# Altium project JLB_PCB.PrjPcb (part 1 of 2)
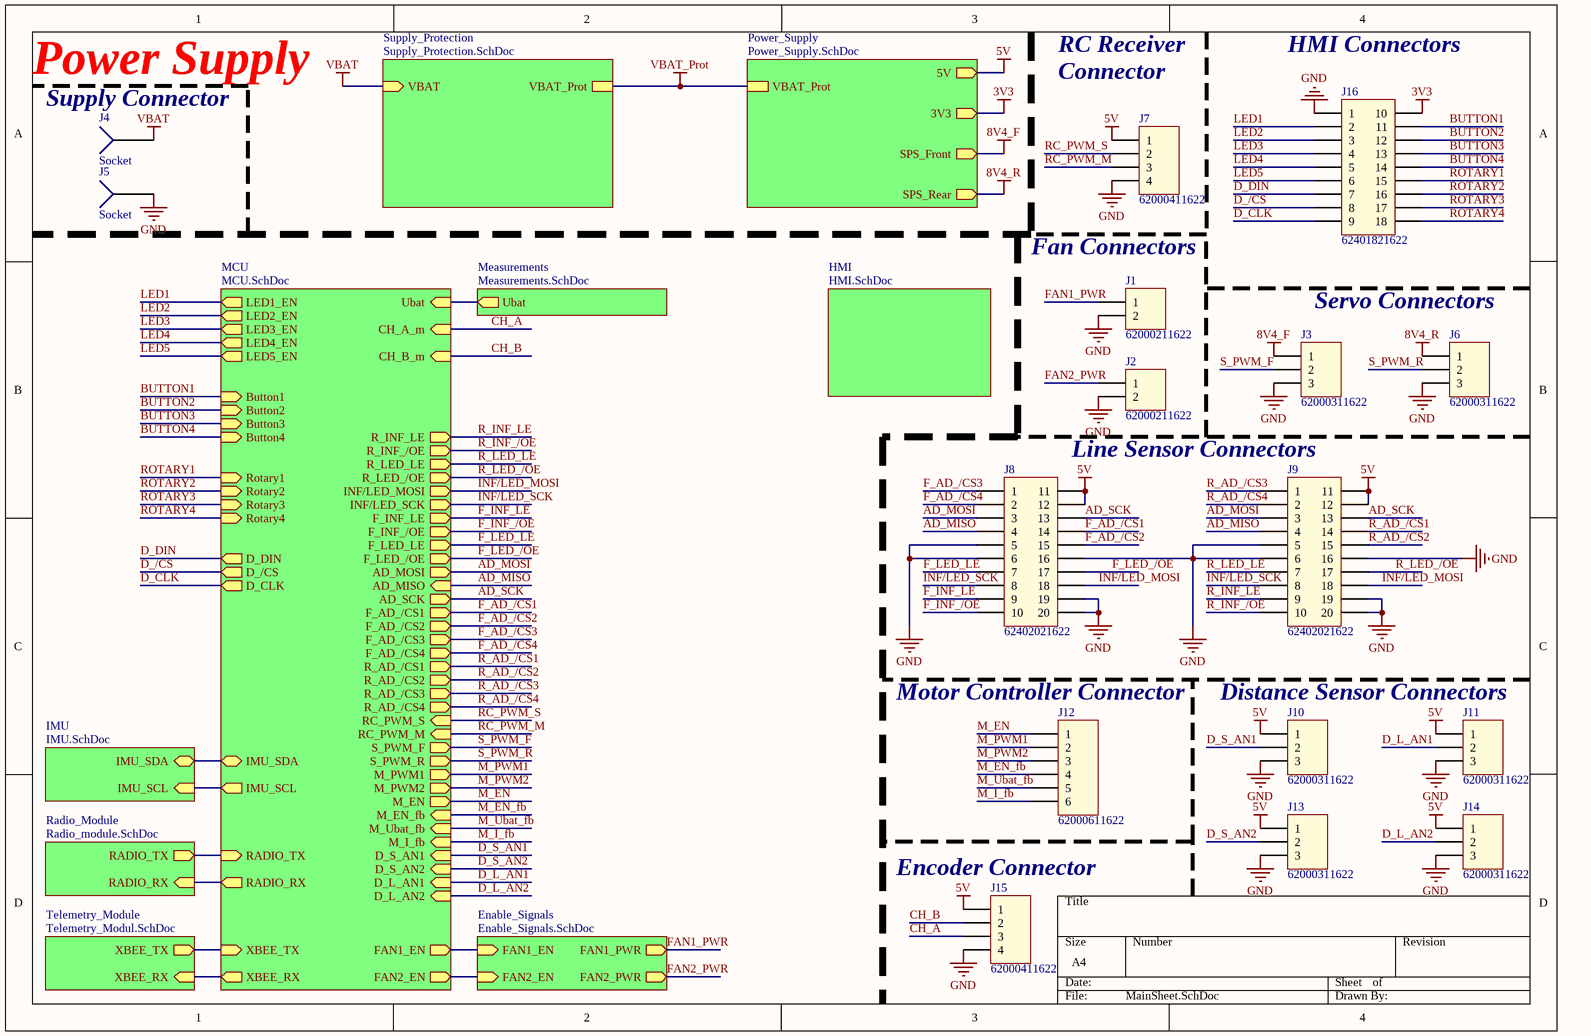
[diagram p0: MainSheet.SchDoc]
18 sheets, 177 parts. Net scope: hierarchical (ports join the sheet entries above them; power ports are global).
Board file: JLB_PCB.PcbDoc
Sheets:
  MainSheet.SchDoc
    MCU = MCU.SchDoc
    Supply_Protection = Supply_Protection.SchDoc
    Power_Supply = Power_Supply.SchDoc
      5V_Supply = 5V_Supply.SchDoc
      3V3_Supply = 3V3_Supply.SchDoc
      Servo_Power_Supply = Servo_Power_Supply.SchDoc
        Front_Servo_Supply = Front_Servo_Supply.SchDoc
        Rear_Servo_Supply = Rear_Servo_Supply.SchDoc
    IMU = IMU.SchDoc
    Telemetry_Module = Telemetry_Modul.SchDoc
    Radio_Module = Radio_module.SchDoc
    HMI = HMI.SchDoc
      LEDs = HMI_LEDs.SchDoc
      Buttons & Rotary = HMI_Buttons.SchDoc
      Display = Display.SchDoc
    Measurements = Measurements.SchDoc
    Enable_Signals = Enable_Signals.SchDoc

## Sheet MainSheet.SchDoc
size A4; SheetNumber: 1; SheetTotal: 18

### Parts
J1  62000211622  [62000211622]
J2  62000211622  [62000211622]
J3  62000311622  [62000311622]
J4  Socket  [TAB 6.35MM x 0.81MM]
J5  Socket  [TAB 6.35MM x 0.81MM]
J6  62000311622  [62000311622]
J7  62000411622  [62000411622]
J8  62402021622  [62402021622]
J9  62402021622  [62402021622]
J10  62000311622  [62000311622]
J11  62000311622  [62000311622]
J12  62000611622  [62000611622]
J13  62000311622  [62000311622]
J14  62000311622  [62000311622]
J15  62000411622  [62000411622]
J16  62401821622  [62401821622]

### Sub-sheets
Enable_Signals = Enable_Signals.SchDoc: FAN1_PWR (out), FAN2_PWR (out), FAN1_EN (in), FAN2_EN (in)
HMI = HMI.SchDoc: no entries
IMU = IMU.SchDoc: IMU_SDA (bidir), IMU_SCL (in)
MCU = MCU.SchDoc: Ubat (in), IMU_SDA (bidir), IMU_SCL (out), RADIO_TX (in), RADIO_RX (out), XBEE_TX (in), XBEE_RX (out), FAN2_EN (out), FAN1_EN (out), D_L_AN2 (in), D_L_AN1 (in), D_S_AN2 (in), D_S_AN1 (in), M_I_fb (in), M_Ubat_fb (in), M_EN_fb (in), M_EN (out), M_PWM2 (out), M_PWM1 (out), S_PWM_R (out), S_PWM_F (out), RC_PWM_M (in), RC_PWM_S (in), R_AD_/CS4 (out), R_AD_/CS3 (out), R_AD_/CS2 (out), R_AD_/CS1 (out), F_AD_/CS4 (out), CH_B_m (in), CH_A_m (in), F_AD_/CS3 (out), F_AD_/CS2 (out), F_AD_/CS1 (out), AD_SCK (out), AD_MISO (in), AD_MOSI (out), F_LED_/OE (out), F_LED_LE (out), F_INF_/OE (out), F_INF_LE (out), INF/LED_SCK (out), INF/LED_MOSI (out), R_LED_/OE (out), R_LED_LE (out), R_INF_/OE (out), R_INF_LE (out), LED1_EN (out), LED2_EN (out), LED3_EN (out), LED4_EN (out), LED5_EN (out), Button1 (in), Button3 (in), Button4 (in), Button2 (in), D_DIN (out), D_/CS (out), D_CLK (out), Rotary1 (in), Rotary2 (in), Rotary3 (in), Rotary4 (in)
Measurements = Measurements.SchDoc: Ubat (out)
Power_Supply = Power_Supply.SchDoc: VBAT_Prot, 5V (out), 3V3 (out), SPS_Rear (out), SPS_Front (out)
Radio_Module = Radio_module.SchDoc: RADIO_TX (out), RADIO_RX (in)
Supply_Protection = Supply_Protection.SchDoc: VBAT (in), VBAT_Prot
Telemetry_Module = Telemetry_Modul.SchDoc: XBEE_TX (out), XBEE_RX (in)

### Nets
3V3: J16.10 ; sheet Power_Supply/3V3
5V: J7.1 J8.11 J8.12 J9.11 J9.12 J10.1 J11.1 J13.1 J14.1 J15.1 ; sheet Power_Supply/5V
8V4_F: J3.1 ; sheet Power_Supply/SPS_Front
8V4_R: J6.1 ; sheet Power_Supply/SPS_Rear
GND: J1.2 J2.2 J3.3 J5.1 J6.3 J7.4 J8.5 J8.6 J8.16 J8.19 J8.20 J9.5 J9.6 J9.16 J9.19 J9.20 J10.3 J11.3 J13.3 J14.3 J15.4 J16.1
VBAT: J4.1 ; sheet Supply_Protection/VBAT
VBAT_Prot: sheet Supply_Protection/VBAT_Prot, sheet Power_Supply/VBAT_Prot
AD_MISO: J8.4 J9.4 ; sheet MCU/AD_MISO
AD_MOSI: J8.3 J9.3 ; sheet MCU/AD_MOSI
AD_SCK: J8.13 J9.13 ; sheet MCU/AD_SCK
BUTTON1: J16.11 ; sheet MCU/Button1
BUTTON2: J16.12 ; sheet MCU/Button2
BUTTON3: J16.13 ; sheet MCU/Button3
BUTTON4: J16.14 ; sheet MCU/Button4
CH_A: J15.3 ; sheet MCU/CH_A_m
CH_B: J15.2 ; sheet MCU/CH_B_m
D_/CS: J16.8 ; sheet MCU/D_/CS
D_CLK: J16.9 ; sheet MCU/D_CLK
D_DIN: J16.7 ; sheet MCU/D_DIN
D_L_AN1: J11.2 ; sheet MCU/D_L_AN1  [project net AIN3]
D_L_AN2: J14.2 ; sheet MCU/D_L_AN2  [project net AIN4]
D_S_AN1: J10.2 ; sheet MCU/D_S_AN1  [project net AIN1]
D_S_AN2: J13.2 ; sheet MCU/D_S_AN2  [project net AIN2]
F_AD_/CS1: J8.14 ; sheet MCU/F_AD_/CS1  [project net ADCF1]
F_AD_/CS2: J8.15 ; sheet MCU/F_AD_/CS2  [project net ADCF2]
F_AD_/CS3: J8.1 ; sheet MCU/F_AD_/CS3  [project net ADCF3]
F_AD_/CS4: J8.2 ; sheet MCU/F_AD_/CS4  [project net ADCF4]
F_INF_/OE: J8.10 ; sheet MCU/F_INF_/OE
F_INF_LE: J8.9 ; sheet MCU/F_INF_LE  [project net ILEF]
F_LED_/OE: J8.17 ; sheet MCU/F_LED_/OE
F_LED_LE: J8.7 ; sheet MCU/F_LED_LE
FAN1: sheet MCU/FAN1_EN, sheet Enable_Signals/FAN1_EN
FAN1_PWR: J1.1 ; sheet Enable_Signals/FAN1_PWR
FAN2: sheet MCU/FAN2_EN, sheet Enable_Signals/FAN2_EN
FAN2_PWR: J2.1 ; sheet Enable_Signals/FAN2_PWR
INF/LED_MOSI: J8.18 J9.18 ; sheet MCU/INF/LED_MOSI
INF/LED_SCK: J8.8 J9.8 ; sheet MCU/INF/LED_SCK
LED1: J16.2 ; sheet MCU/LED1_EN
LED2: J16.3 ; sheet MCU/LED2_EN
LED3: J16.4 ; sheet MCU/LED3_EN
LED4: J16.5 ; sheet MCU/LED4_EN
LED5: J16.6 ; sheet MCU/LED5_EN
LV_BATT: sheet MCU/Ubat, sheet Measurements/Ubat
M_EN: J12.1 ; sheet MCU/M_EN  [project net DRIVE_EN]
M_EN_fb: J12.4 ; sheet MCU/M_EN_fb  [project net FB]
M_I_fb: J12.6 ; sheet MCU/M_I_fb  [project net CURR]
M_PWM1: J12.2 ; sheet MCU/M_PWM1
M_PWM2: J12.3 ; sheet MCU/M_PWM2
M_Ubat_fb: J12.5 ; sheet MCU/M_Ubat_fb  [project net BATT]
R_AD_/CS1: J9.14 ; sheet MCU/R_AD_/CS1  [project net ADCR1]
R_AD_/CS2: J9.15 ; sheet MCU/R_AD_/CS2  [project net ADCR2]
R_AD_/CS3: J9.1 ; sheet MCU/R_AD_/CS3  [project net ADCR3]
R_AD_/CS4: J9.2 ; sheet MCU/R_AD_/CS4  [project net ADCR4]
R_INF_/OE: J9.10 ; sheet MCU/R_INF_/OE  [project net IOER]
R_INF_LE: J9.9 ; sheet MCU/R_INF_LE  [project net ILER]
R_LED_/OE: J9.17 ; sheet MCU/R_LED_/OE
R_LED_LE: J9.7 ; sheet MCU/R_LED_LE
RADIO_RX: sheet MCU/RADIO_RX, sheet Radio_Module/RADIO_RX
RADIO_TX: sheet MCU/RADIO_TX, sheet Radio_Module/RADIO_TX
RC_PWM_M: J7.3 ; sheet MCU/RC_PWM_M
RC_PWM_S: J7.2 ; sheet MCU/RC_PWM_S
ROTARY1: J16.15 ; sheet MCU/Rotary1
ROTARY2: J16.16 ; sheet MCU/Rotary2
ROTARY3: J16.17 ; sheet MCU/Rotary3
ROTARY4: J16.18 ; sheet MCU/Rotary4
S_PWM_F: J3.2 ; sheet MCU/S_PWM_F
S_PWM_R: J6.2 ; sheet MCU/S_PWM_R
SCL: sheet MCU/IMU_SCL, sheet IMU/IMU_SCL
SDA: sheet MCU/IMU_SDA, sheet IMU/IMU_SDA
XBEE_RX: sheet MCU/XBEE_RX, sheet Telemetry_Module/XBEE_RX
XBEE_TX: sheet MCU/XBEE_TX, sheet Telemetry_Module/XBEE_TX

### Notes on the sheet
- Power Supply
- (near J4) Supply Connector
- RC Receiver
- Connector
- HMI Connectors
- Fan Connectors
- Servo Connectors
- Line Sensor Connectors
- (near J12) Motor Controller Connector
- Distance Sensor Connectors
- (near J15) Encoder Connector

### Library data of the parts
J1 J2 = 62000211622: WR-WTB 2.00mm Male Vertical Shrouded Header, 2p; Pin Number: 2; ID: WE 1x2 Vertical THT; Note: Positive Lock; ComponentLink1Description: Manufacturer; ComponentLink1URL: http://www.we-online.de; ComponentLink2Description: Datasheet; ComponentLink2URL: http://katalog.we-online.de/em/datasheet/6200xx11622.pdf; Part Number: 62000211622; Published Date: June 2017; Publisher: Wurth Elektronik; Pitch: 2.00 mm; Order Number: 62000211622; Package: 62000211622; NI part number: -; NI PEN/DEB: -; Type: Header WE 2-way; Distributor: Würth; Link: http://katalog.we-online.de/em/datasheet/6200xx11622.pdf; Price (HUF): 0
J3 J6 J10 J11 J13 J14 = 62000311622: WR-WTB 2.00mm Male Vertical Shrouded Header, 3p; Pin Number: 3; ID: WE 1x3 Vertical THT; Note: Positive Lock; ComponentLink1Description: Manufacturer; ComponentLink1URL: http://www.we-online.de; ComponentLink2Description: Datasheet; ComponentLink2URL: http://katalog.we-online.de/em/datasheet/6200xx11622.pdf; Part Number: 62000311622; Published Date: June 2017; Publisher: Wurth Elektronik; Pitch: 2.00 mm; Order Number: 62000311622; Package: 62000311622; NI part number: -; NI PEN/DEB: -; Type: Header WE 3-way; Distributor: Würth; Link: http://katalog.we-online.de/em/datasheet/6200xx11622.pdf; Price (HUF): 0
J4 J5 = 1217861-1 TERMINAL: ID: Con_1217861-1 TERMINAL; Order number: 1924184; Distributor: Farnell; Link: http://hu.farnell.com/te-connectivity-amp/1217861-1/terminal-tab-6-35mm-x-0-81mm-solder/dp/1924184?ost=1924184&selectedCategoryId=&categoryName=%C3%96sszes+kateg%C3%B3ria&categoryNameResp=%C3%96sszes+kateg%C3%B3ria; Package: TAB 6.35MM x 0.81MM; Part Number: 1217861-1 TERMINAL; Price (HUF): 22; Type: TAB; NI part number: -; NI PEN/DEB: -
J7 J15 = 62000411622: WR-WTB 2.00mm Male Vertical Shrouded Header, 4p; Pin Number: 4; ID: WE 1x4 Vertical THT; Note: Positive Lock; ComponentLink1Description: Manufacturer; ComponentLink1URL: http://www.we-online.de; ComponentLink2Description: Datasheet; ComponentLink2URL: http://katalog.we-online.de/em/datasheet/6200xx11622.pdf; Part Number: 62000411622; Published Date: June 2017; Publisher: Wurth Elektronik; Pitch: 2.00 mm; Order Number: 62000411622; Package: 62000411622; NI part number: -; NI PEN/DEB: -; Type: Header WE 4-way; Distributor: Würth; Link: http://katalog.we-online.de/em/datasheet/6200xx11622.pdf; Price (HUF): 0
J8 J9 = 62402021622: WR-WTB 2.00mm Male Dual Row Vertical Shrouded Header with positive locking, 20p; Pin Number: 20; ID: WE 2x10 Vertical THT; ComponentLink1Description: Manufacturer; ComponentLink1URL: http://www.we-online.de; ComponentLink2Description: Datasheet; ComponentLink2URL: http://katalog.we-online.de/em/datasheet/6240xx21622.pdf; Part Number: 62402021622; Published Date: June 2017; Publisher: Wurth Elektronik; Pitch: 2.00 mm; Order Number: 62402021622; Package: 62402021622; NI part number: -; NI PEN/DEB: -; Type: Header WE 20-way; Distributor: Würth; Link: http://katalog.we-online.de/em/datasheet/6240xx21622.pdf; Price (HUF): 0; Note: Positive Lock
J12 = 62000611622: WR-WTB 2.00mm Male Vertical Shrouded Header, 6p; Pin Number: 6; ID: WE 1x6 Vertical THT; Note: Positive Lock; ComponentLink1Description: Manufacturer; ComponentLink1URL: http://www.we-online.de; ComponentLink2Description: Datasheet; ComponentLink2URL: http://katalog.we-online.de/em/datasheet/6200xx11622.pdf; Part Number: 62000611622; Published Date: June 2017; Publisher: Wurth Elektronik; Pitch: 2.00 mm; Order Number: 62000611622; Package: 62000611622; NI part number: -; NI PEN/DEB: -; Type: Header WE 6-way; Distributor: Würth; Link: http://katalog.we-online.de/em/datasheet/6200xx11622.pdf; Price (HUF): 0
J16 = 62401821622: WR-WTB 2.00mm Male Dual Row Vertical Shrouded Header with positive locking, 18p; Pin Number: 18; ID: WE 2x9 Vertical THT; ComponentLink1Description: Manufacturer; ComponentLink1URL: http://www.we-online.de; ComponentLink2Description: Datasheet; ComponentLink2URL: http://katalog.we-online.de/em/datasheet/6240xx21622.pdf; Part Number: 62401821622; Published Date: June 2017; Publisher: Wurth Elektronik; Pitch: 2.00 mm; Order Number: 62401821622; Package: 62401821622; NI part number: -; NI PEN/DEB: -; Type: Header WE 18-way; Distributor: Würth; Link: http://katalog.we-online.de/em/datasheet/6240xx21622.pdf; Price (HUF): 0; Note: Positive Lock

## Sheet MCU.SchDoc
size A4; SheetNumber: 2; SheetTotal: 18
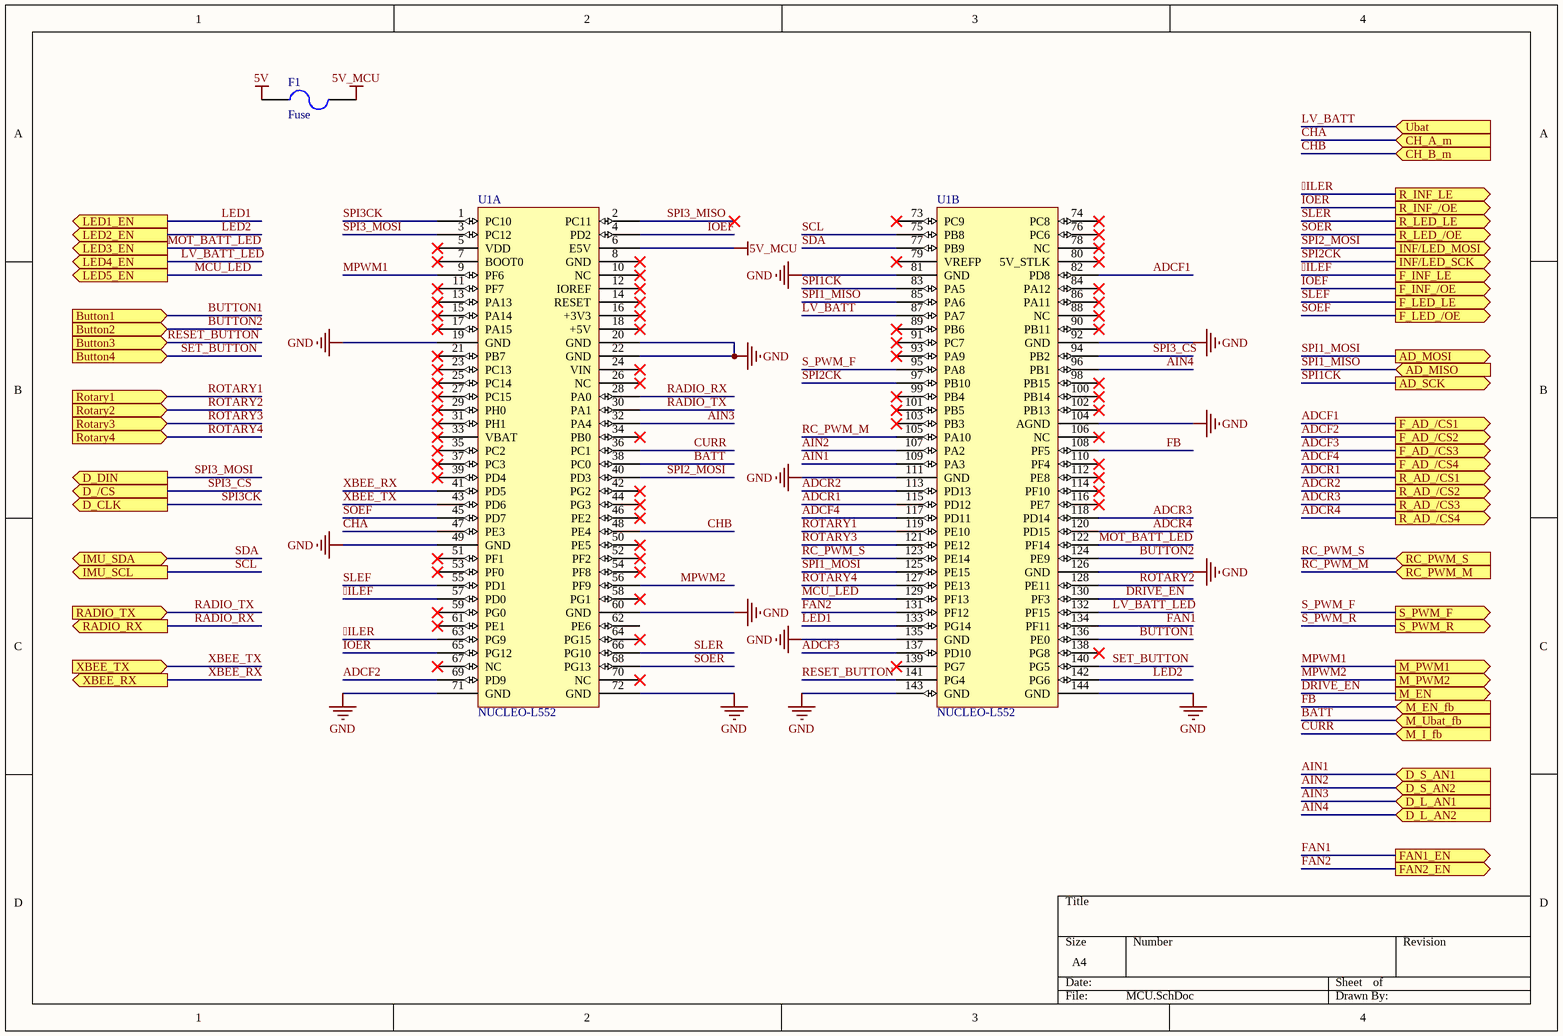
[diagram p1: MCU.SchDoc]

### Parts
F1  Fuse  [F_0603]
U1  NUCLEO-L552  [FP_NUCLEO-144]  (parts A,B of 2)

### Ports
AD_MISO (in), AD_MOSI (out), AD_SCK (out), Button1 (in), Button2 (in), Button3 (in), Button4 (in), CH_A_m (in), CH_B_m (in), D_/CS (out), D_CLK (out), D_DIN (out), D_L_AN1 (in), D_L_AN2 (in), D_S_AN1 (in), D_S_AN2 (in), F_AD_/CS1 (out), F_AD_/CS2 (out), F_AD_/CS3 (out), F_AD_/CS4 (out), F_INF_/OE (out), F_INF_LE (out), F_LED_/OE (out), F_LED_LE (out), FAN1_EN (out), FAN2_EN (out), IMU_SCL (out), IMU_SDA (bidir), INF/LED_MOSI (out), INF/LED_SCK (out), LED1_EN (out), LED2_EN (out), LED3_EN (out), LED4_EN (out), LED5_EN (out), M_EN (out), M_EN_fb (in), M_I_fb (in), M_PWM1 (out), M_PWM2 (out), M_Ubat_fb (in), R_AD_/CS1 (out), R_AD_/CS2 (out), R_AD_/CS3 (out), R_AD_/CS4 (out), R_INF_/OE (out), R_INF_LE (out), R_LED_/OE (out), R_LED_LE (out), RADIO_RX (out), RADIO_TX (in), RC_PWM_M (in), RC_PWM_S (in), Rotary1 (in), Rotary2 (in), Rotary3 (in), Rotary4 (in), S_PWM_F (out), S_PWM_R (out), Ubat (in), XBEE_RX (out), XBEE_TX (in)

### Nets
5V: F1.1
5V_MCU: F1.2 U1.6(E5V)
GND: U1.19(GND) U1.20(GND) U1.22(GND) U1.49(GND) U1.60(GND) U1.71(GND) U1.72(GND) U1.81(GND) U1.92(GND) U1.104(AGND) U1.111(GND) U1.126(GND) U1.135(GND) U1.143(GND) U1.144(GND)
ILEF: U1.57(PD0) ; port F_INF_LE
ILER: U1.63(PG9) ; port R_INF_LE
ADCF1: U1.82(PD8) ; port F_AD_/CS1
ADCF2: U1.69(PD9) ; port F_AD_/CS2
ADCF3: U1.137(PD10) ; port F_AD_/CS3
ADCF4: U1.117(PD11) ; port F_AD_/CS4
ADCR1: U1.115(PD12) ; port R_AD_/CS1
ADCR2: U1.113(PD13) ; port R_AD_/CS2
ADCR3: U1.118(PD14) ; port R_AD_/CS3
ADCR4: U1.120(PD15) ; port R_AD_/CS4
AIN1: U1.109(PA3) ; port D_S_AN1
AIN2: U1.107(PA2) ; port D_S_AN2
AIN3: U1.32(PA4) ; port D_L_AN1
AIN4: U1.96(PB1) ; port D_L_AN2
BATT: U1.38(PC0) ; port M_Ubat_fb
BUTTON1: U1.136(PE0) ; port Button1
BUTTON2: U1.124(PE9) ; port Button2
CHA: U1.47(PE3) ; port CH_A_m  [project net CH_A]
CHB: U1.48(PE4) ; port CH_B_m  [project net CH_B]
CURR: U1.36(PC1) ; port M_I_fb
DRIVE_EN: U1.130(PF3) ; port M_EN
FAN1: U1.134(PF11) ; port FAN1_EN
FAN2: U1.131(PF12) ; port FAN2_EN
FB: U1.108(PF5) ; port M_EN_fb
IOEF: U1.4(PD2) ; port F_INF_/OE  [project net F_INF_/OE]
IOER: U1.65(PG12) ; port R_INF_/OE
LED1: U1.133(PG14) ; port LED1_EN
LED2: U1.142(PG6) ; port LED2_EN
LV_BATT: U1.87(PA7) ; port Ubat
LV_BATT_LED: U1.132(PF15) ; port LED4_EN  [project net LED4]
MCU_LED: U1.129(PF13) ; port LED5_EN  [project net LED5]
MOT_BATT_LED: U1.122(PF14) ; port LED3_EN  [project net LED3]
MPWM1: U1.9(PF6) ; port M_PWM1  [project net M_PWM1]
MPWM2: U1.56(PF9) ; port M_PWM2  [project net M_PWM2]
RADIO_RX: U1.28(PA0) ; port RADIO_RX
RADIO_TX: U1.30(PA1) ; port RADIO_TX
RC_PWM_M: U1.105(PA10) ; port RC_PWM_M
RC_PWM_S: U1.123(PE14) ; port RC_PWM_S
RESET_BUTTON: U1.141(PG4) ; port Button3  [project net BUTTON3]
ROTARY1: U1.119(PE10) ; port Rotary1
ROTARY2: U1.128(PE11) ; port Rotary2
ROTARY3: U1.121(PE12) ; port Rotary3
ROTARY4: U1.127(PE13) ; port Rotary4
S_PWM_F: U1.95(PA8) ; port S_PWM_F
SCL: U1.75(PB8) ; port IMU_SCL
SDA: U1.77(PB9) ; port IMU_SDA
SET_BUTTON: U1.140(PG5) ; port Button4  [project net BUTTON4]
SLEF: U1.55(PD1) ; port F_LED_LE  [project net F_LED_LE]
SLER: U1.66(PG10) ; port R_LED_LE  [project net R_LED_LE]
SOEF: U1.45(PD7) ; port F_LED_/OE  [project net F_LED_/OE]
SOER: U1.68(PG13) ; port R_LED_/OE  [project net R_LED_/OE]
SPI1_MISO: U1.85(PA6) ; port AD_MISO  [project net AD_MISO]
SPI1_MOSI: U1.125(PE15) ; port AD_MOSI  [project net AD_MOSI]
SPI1CK: U1.83(PA5) ; port AD_SCK  [project net AD_SCK]
SPI2_MOSI: U1.40(PD3) ; port INF/LED_MOSI  [project net INF/LED_MOSI]
SPI2CK: U1.97(PB10) ; port INF/LED_SCK  [project net INF/LED_SCK]
SPI3_CS: U1.94(PB2) ; port D_/CS  [project net D_/CS]
SPI3_MISO: U1.2(PC11)
SPI3_MOSI: U1.3(PC12) ; port D_DIN  [project net D_DIN]
SPI3CK: U1.1(PC10) ; port D_CLK  [project net D_CLK]
XBEE_RX: U1.41(PD5) ; port XBEE_RX
XBEE_TX: U1.43(PD6) ; port XBEE_TX

Not connected (* = marked no-connect by the designer): U1 5(VDD)* 7(BOOT0)* 8(GND)* 10(NC)* 11(PF7)* 12(IOREF)* 13(PA13)* 14(RESET)* 15(PA14)* 16(+3V3)* 17(PA15)* 18(+5V)* 21(PB7)* 23(PC13)* 24(VIN)* 25(PC14)* 26(NC)* 27(PC15)* 29(PH0)* 31(PH1)* 33(VBAT)* 34(PB0)* 35(PC2)* 37(PC3)* 39(PD4)* 42(PG2)* 44(PG3)* 46(PE2)* 50(PE5)* 51(PF1)* 52(PF2)* 53(PF0)* 54(PF8)* 58(PG1)* 59(PG0)* 61(PE1)* 62(PE6) 64(PG15)* 67(NC)* 70(NC)* 73(PC9)* 74(PC8)* 76(PC6)* 78(NC)* 79(VREFP)* 80(5V_STLK)* 84(PA12)* 86(PA11)* 88(NC)* 89(PB6)* 90(PB11)* 91(PC7)* 93(PA9)* 98(PB15)* 99(PB4)* 100(PB14)* 101(PB5)* 102(PB13)* 103(PB3)* 106(NC)* 110(PF4)* 112(PE8)* 114(PF10)* 116(PE7)* 138(PG8)* 139(PG7)*

### Library data of the parts
F1 = Oth_MC06CF.500_F_0603: NI part number: 766324-01; Order number: 1841006; Rating: 32VDC; Type: Very Fast Acting Fuse; Value: 500mA; NI PEN/DEB: DEB; Distributor: Farnell; ID: Oth_MC06CF.500_F_0603; Link: http://hu.farnell.com/multicomp/mc06cf-500/fuse-smd-0603-0-5a/dp/1841006; Package: F_0603; Part Number: MC06CF.500; Price (HUF): 125
U1 = NUCLEO-L552: https://www.st.com/resource/en/user_manual/um2581-stm32l5-nucleo144-board-mb1361-stmicroelectronics.pdf; Reference: NUCLEO; Name: Nucleo L552; Supplier: Tanszék

## Sheet Supply_Protection.SchDoc
size A4; SheetNumber: 3; SheetTotal: 18
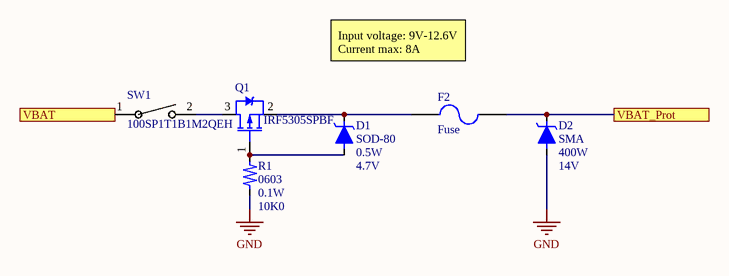
[diagram p2: Supply_Protection.SchDoc]

### Parts
D1  SOD-80  value 4.7V  Rating: 0.5W  [SOD-80]
D2  SMA  value 14V  Rating: 400W  [SMA]
F2  Fuse  [F_2410]
Q1  IRF5305SPBF  [D2PAK-2]
R1  0603  value 10K0  Rating: 0.1W  [R_0603]
SW1  100SP1T1B1M2QEH  [SW_100SP1T_12P7X6P86_EWI]

### Ports
VBAT (in), VBAT_Prot

### Nets
GND: D2.2(DA) R1.1(R1)
VBAT: SW1.1 ; port VBAT
VBAT_Prot: D2.1(DC) F2.2 ; port VBAT_Prot
NetD1_1: D1.1(DC) F2.1 Q1.2(S)
NetD1_2: D1.2(DA) Q1.1(G) R1.2(R2)
NetQ1_3: Q1.3(D) SW1.2

### Notes on the sheet
- Input voltage: 9V-12.6V
  Current max: 8A

### Library data of the parts
D1 = TZMC4V7GS08: Type: Zener Diode; ID: Dio_SOD-80_4.7V_0.5W_Zener; Distributor: Lomex; Link: http://lomex.hu/hu/webshop/#/page,0/search,85-00-95/stype,1/sidx,1; Order Number: 85-00-95; Package: SOD-80; Part Number: TZMC4V7GS08; Price (HUF): 5; NI part number: -; NI PEN/DEB: -
D2 = SMAJ12A: Type: Transient Voltage Suppressor; ID: Dio_SMA_14V_400W_Transient_Sup; Distributor: Lomex; Link: http://lomex.hu/hu/webshop/#/page,0/search,96-00-77/stype,1/sidx,1; Order Number: 96-00-77; Package: SMA; Part Number: SMAJ12A; Price (HUF): 17; NI part number: -; NI PEN/DEB: -
F2 = 0451003.MRL: ID: Oth_0451003.MRL_F_2410; Rating: 125V; Type: Very Fast Acting Fuse; Value: 3A; Distributor: Lomex; Link: http://lomex.hu/hu/webshop/#page,0/search,44-02-68/stype,1; Order number: 44-02-68; Package: F_2410; Part Number: 0451003.MRL; Price (HUF): 33; NI part number: -; NI PEN/DEB: -
Q1 = IRF5305SPBF: P-Channel Power MOSFET; ID: Tra_D2PAK-2_55V_31A_P-FET; Rating: 31A; Type: P-FET; Value: 55V; Distributor: Lomex; Link: http://lomex.hu/hu/webshop/#/page,0/stype,1/sidx,10/instock,0/search,86-02-47; Order number: 86-02-47; Package: D2PAK-2; Part Number: IRF5305SPBF; Price (HUF): 230; NI part number: -; NI PEN/DEB: -
R1 = CR-03FL7---10K: NI part number: 713771-01; Tolerance: 1%; ID: Res_0603_10K0_0.1W_Chip; NI PEN/DEB: DEB; Type: Chip Resistor; Part Number: CR-03FL7---10K; Order Number: 80-11-68; Distributor: Lomex; Link: http://lomex.hu/hu/webshop/#/page,0/search,80-11-68/stype,1/sidx,1; Price (HUF): 0.80; Package: 0603
SW1 = 100SP1T1B1M2QEH: No Description Available; Mfr_Name: E-Switch; Copyright: Copyright (C) 2023 Ultra Librarian. All rights reserved.; Manufacturer_Part_Number: 100SP1T1B1M2QEH

## Sheet Power_Supply.SchDoc
size A4; SheetNumber: 4; SheetTotal: 18
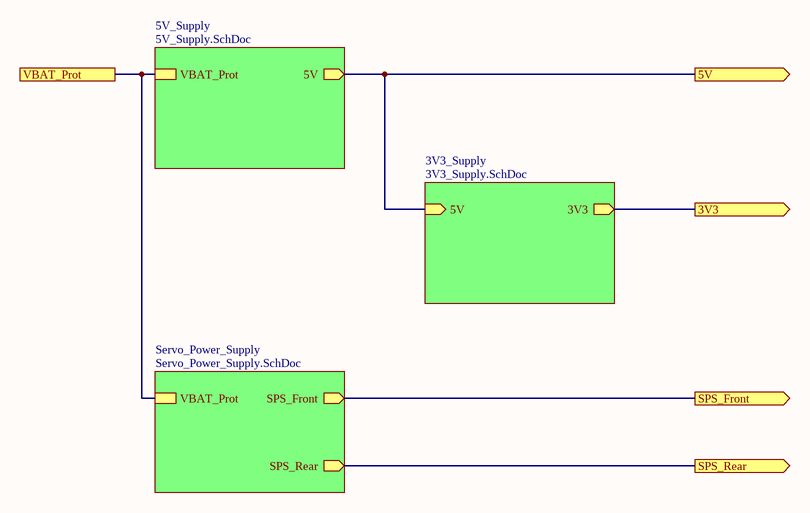
[diagram p3: Power_Supply.SchDoc]

### Sub-sheets
3V3_Supply = 3V3_Supply.SchDoc: 5V (in), 3V3 (out)
5V_Supply = 5V_Supply.SchDoc: VBAT_Prot, 5V (out)
Servo_Power_Supply = Servo_Power_Supply.SchDoc: VBAT_Prot, SPS_Front (out), SPS_Rear (out)

### Ports
3V3 (out), 5V (out), SPS_Front (out), SPS_Rear (out), VBAT_Prot

### Nets
3V3: port 3V3, sheet 3V3_Supply/3V3
5V: port 5V, sheet 5V_Supply/5V, sheet 3V3_Supply/5V
8V4_F: port SPS_Front, sheet Servo_Power_Supply/SPS_Front
8V4_R: port SPS_Rear, sheet Servo_Power_Supply/SPS_Rear
VBAT_Prot: port VBAT_Prot, sheet 5V_Supply/VBAT_Prot, sheet Servo_Power_Supply/VBAT_Prot

## Sheet 5V_Supply.SchDoc
size A4; SheetNumber: 5; SheetTotal: 18
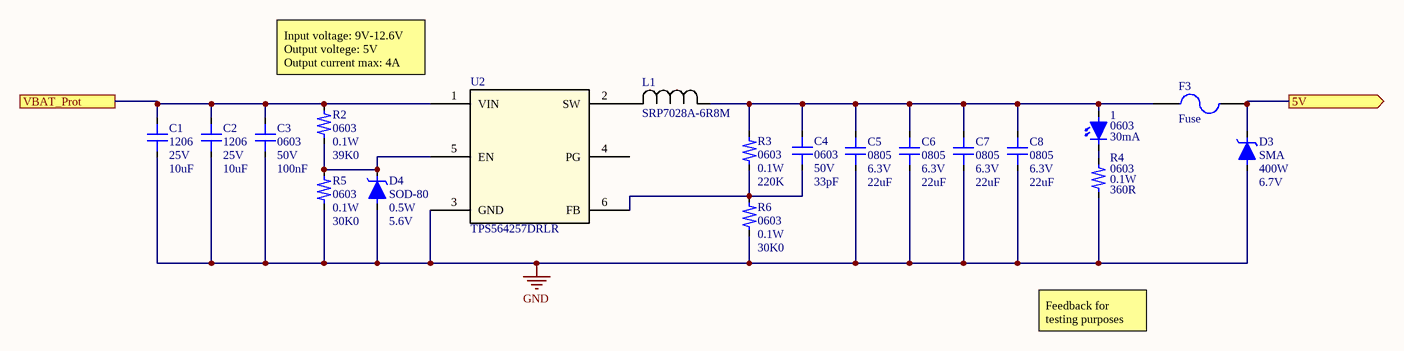
[diagram p4: 5V_Supply.SchDoc]

### Parts
1  0603  Rating: 30mA  [LED_0603]
C1  1206  value 10uF  Rating: 25V  [C_1206]
C2  1206  value 10uF  Rating: 25V  [C_1206]
C3  0603  value 100nF  Rating: 50V  [C_0603]
C4  0603  value 33pF  Rating: 50V  [C_0603]
C5  0805  value 22uF  Rating: 6.3V  [C_0805]
C6  0805  value 22uF  Rating: 6.3V  [C_0805]
C7  0805  value 22uF  Rating: 6.3V  [C_0805]
C8  0805  value 22uF  Rating: 6.3V  [C_0805]
D3  SMA  value 6.7V  Rating: 400W  [SMA]
D4  SOD-80  value 5.6V  Rating: 0.5W  [SOD-80]
F3  Fuse  [F_2410]
L1  SRP7028A-6R8M  [IND_SRP7028A-6R8M_BRN]
R2  0603  value 39K0  Rating: 0.1W  [R_0603]
R3  0603  value 220K  Rating: 0.1W  [R_0603]
R4  0603  value 360R  Rating: 0.1W  [R_0603]
R5  0603  value 30K0  Rating: 0.1W  [R_0603]
R6  0603  value 30K0  Rating: 0.1W  [R_0603]
U2  TPS564257DRLR  [TPS564242DRLR_TEX]

### Ports
5V (out), VBAT_Prot

### Nets
5V: D3.1(DC) F3.2 ; port 5V
GND: C1.1(C1) C2.1(C1) C3.1(C1) C5.1(C1) C6.1(C1) C7.1(C1) C8.1(C1) D3.2(DA) D4.2(DA) R4.1(R1) R5.1(R1) R6.1(R1) U2.3(GND)
VBAT_Prot: C1.2(C2) C2.2(C2) C3.2(C2) R2.2(R2) U2.1(VIN) ; port VBAT_Prot
Net1_1: 1.1(DC) R4.2(R2)
Net1_2: 1.2(DA) C4.2(C2) C5.2(C2) C6.2(C2) C7.2(C2) C8.2(C2) F3.1 L1.1 R3.1(R1)
NetC4_1: C4.1(C1) R3.2(R2) R6.2(R2) U2.6(FB)
NetD4_1: D4.1(DC) R2.1(R1) R5.2(R2) U2.5(EN)
NetL1_2: L1.2 U2.2(SW)

Not connected (* = marked no-connect by the designer): U2 4(PG)

### Notes on the sheet
- Input voltage: 9V-12.6V
  Output voltege: 5V
  Output current max: 4A
- Feedback for testing purposes

### Library data of the parts
1 = Opt_FYLS-0603UGC_LED_0603_Green_30mA_Diode_LED: Note: 40mcd; Tolerance: 5%; Distributor: Lomex; Link: http://lomex.hu/hu/webshop/#/page,0/stype,1/sidx,10/instock,0/search,95-03-08; Order Number: 95-03-08; Package: 0603; Part Number: FYLS-0603UGC; Price (HUF): 10; Type: LED; ID: Opt_FYLS-0603UGC_LED_0603_Green_30mA_Diode_LED
C1 C2 = C3216X7R1E106K160AB: Type: Chip Capacitor; Tolerance: 10%; Order Number: 2522133; ID: Cap_1206_10uF_25V_Chip; Part Number: C3216X7R1E106K160AB; Distributor: Farnell; Link: http://hu.farnell.com/tdk/c3216x7r1e106k160ab/capacitor-mlcc-x7r-10uf-25v-1206/dp/2522133; Price (HUF): 109; Package: 1206; NI Part Number: -; NI PEN/DEB: -
C3 = CC0603KRX7R9BB104: NI Part Number: 716340-01; Type: Chip Capacitor; Tolerance: 10%; ID: Cap_0603_100nF_50V_Chip; NI PEN/DEB: DEB; Part Number: CC0603KRX7R9BB104; Order Number: 82-06-23; Distributor: Lomex; Link: http://lomex.hu/hu/webshop/#/page,0/search,82-06-23/stype,1/sidx,1; Price (HUF): 2.00; Package: 0603
C4 = CL10C330JB8NNNC: NI Part Number: 715511-01; Type: Chip Capacitor; Tolerance: 5%; ID: Cap_0603_33pF_50V_Chip; NI PEN/DEB: DEB; Part Number: CL10C330JB8NNNC; Order Number: 82-09-74; Distributor: Lomex; Link: http://lomex.hu/hu/webshop/#/page,0/search,82-09-74/stype,1/sidx,1; Price (HUF): 2.00; Package: 0603
C5-C8 = CL21A226MQQNNNG: Type: Chip Capacitor; Tolerance: 20%; ID: Cap_0805_22uF_6.3V_Chip; Part Number: CL21A226MQQNNNG; Order Number: 82-08-19; Distributor: Lomex; Link: http://lomex.hu/hu/webshop/#/page,0/search,82-08-19/stype,1/sidx,1; Price (HUF): 2.00; Package: 0805; NI Part Number: -; NI PEN/DEB: -
D3 = SMAJ5.0A: Tolerance: 5%; Type: Transient Voltage Suppressor; ID: Dio_SMA_6.7V_400W_Transient_Sup; Distributor: Lomex; Link: http://lomex.hu/hu/webshop/#/search,96-00-75/stype,1; Order Number: 96-00-75; Package: SMA; Part Number: SMAJ5.0A; Price (HUF): 20; NI part number: -; NI PEN/DEB: -
D4 = BZV55C5V6: Type: Zener Diode; ID: Dio_SOD-80_5.6V_0.5W_Zener; Distributor: Lomex; Link: http://lomex.hu/hu/webshop/#/page,0/search,85-01-72/stype,1/sidx,1; Order Number: 85-01-72; Package: SOD-80; Part Number: BZV55C5V6; Price (HUF): 5; NI part number: -; NI PEN/DEB: -
F3 = 0451003.MRL: as F2 on sheet Supply_Protection; Distributor: Lomex; Link: http://lomex.hu/hu/webshop/#page,0/search,44-02-68/stype,1; Order number: 44-02-68; Package: F_2410; Part Number: 0451003.MRL; Price (HUF): 33; NI part number: -; NI PEN/DEB: -
L1 = SRP7028A-6R8M: No Description Available; Mfr_Name: Bourns Electronics; Type: DEV; Copyright: Copyright (C) 2023 Ultra Librarian. All rights reserved.; Manufacturer_Part_Number: SRP7028A-6R8M; RefDes: RefDes
R2 = CR-03JL7---39K: NI part number: 613245-01; Tolerance: 5%; ID: Res_0603_39K0_0.1W_Chip; NI PEN/DEB: DEB; Type: Chip Resistor; Part Number: CR-03JL7---39K; Order Number: 81-10-45; Distributor: Lomex; Link: http://lomex.hu/hu/webshop/#/page,0/search,81-10-45/stype,1/sidx,1; Price (HUF): 0.80; Package: 0603
R3 = CR-03FL7--220K: NI part number: 612705-01; Tolerance: 1%; ID: Res_0603_220K_0.1W_Chip; NI PEN/DEB: DEB; Type: Chip Resistor; Part Number: CR-03FL7--220K; Order Number: 80-11-75; Distributor: Lomex; Link: http://lomex.hu/hu/webshop/#/page,0/search,80-11-75/stype,1/sidx,1; Price (HUF): 0.80; Package: 0603
R4 = CR-03FL7--360R: Tolerance: 1%; ID: Res_0603_360R_0.1W_Chip; Type: Chip Resistor; Part Number: CR-03FL7--360R; Order Number: 80-13-12; Distributor: Lomex; Link: http://lomex.hu/hu/webshop/#/page,0/search,80-13-12/stype,1/sidx,1; Price (HUF): 0.80; Package: 0603; NI part number: -; NI PEN/DEB: -
R5 R6 = CR-03FL7---30K: NI part number: 612699-01; Tolerance: 1%; Note: NI: not in stock; ID: Res_0603_30K0_0.1W_Chip; NI PEN/DEB: DEB; Type: Chip Resistor; Part Number: CR-03FL7---30K; Order Number: 80-14-53; Distributor: Lomex; Link: http://lomex.hu/hu/webshop/#/page,0/search,80-14-53/stype,1/sidx,1; Price (HUF): 0.80; Package: 0603
U2 = TPS564257DRLR: No Description Available; Mfr_Name: Texas Instruments; Type: DEV; Copyright: Copyright (C) 2023 Ultra Librarian. All rights reserved.; Manufacturer_Part_Number: TPS564257DRLR; RefDes: RefDes

## Sheet 3V3_Supply.SchDoc
size A4; SheetNumber: 6; SheetTotal: 18
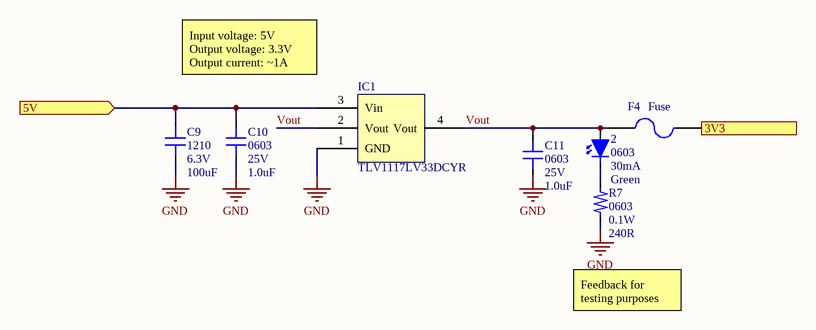
[diagram p5: 3V3_Supply.SchDoc]

### Parts
2  0603  value Green  Rating: 30mA  [LED_0603]
C9  1210  value 100uF  Rating: 6.3V  [C_1210]
C10  0603  value 1.0uF  Rating: 25V  [C_0603]
C11  0603  value 1.0uF  Rating: 25V  [C_0603]
F4  Fuse  [FUSE_1206]
IC1  TLV1117LV33DCYR  [SOT-223]
R7  0603  value 240R  Rating: 0.1W  [R_0603]

### Ports
3V3 (out), 5V (in)

### Nets
3V3: F4.2 ; port 3V3
5V: C9.2(C2) C10.2(C2) IC1.3(Vin) ; port 5V
GND: C9.1(C1) C10.1(C1) C11.1(C1) IC1.1(GND) R7.1(R1)
Vout: 2.2(DA) C11.2(C2) F4.1 IC1.2(Vout) IC1.4(Vout)
Net2_1: 2.1(DC) R7.2(R2)

### Notes on the sheet
- Input voltage: 5V
  Output voltage: 3.3V
  Output current: ~1A
- Feedback for testing purposes

### Library data of the parts
2 = Opt_FYLS-0603UGC_LED_0603_Green_30mA_Diode_LED: Note: 40mcd; Tolerance: 5%; Distributor: Lomex; Link: http://lomex.hu/hu/webshop/#/page,0/stype,1/sidx,10/instock,0/search,95-03-08; Order Number: 95-03-08; Package: 0603; Part Number: FYLS-0603UGC; Price (HUF): 10; Type: LED; ID: Opt_FYLS-0603UGC_LED_0603_Green_30mA_Diode_LED
C9 = 885012109004: Type: Chip Capacitor; Tolerance: 10%; ID: 1210_100uF_6.3V; Part Number: 885012109004; Order Number: 885012109004; Distributor: Würth; Link: http://katalog.we-online.com/en/pbs/WCAP-CSGP-1210/885012209071?_ga=2.179279780.1074345052.1540129169-1833754390.1539103246; Price (HUF): 0; Package: 1210; NI Part Number: -; NI PEN/DEB: -
C10 C11 = CL10A105KA8NNNC: Type: Chip Capacitor; Tolerance: 10%; ID: Cap_0603_1.0uF_25V_Chip; Part Number: CL10A105KA8NNNC; Order Number: 82-07-86; Distributor: Lomex; Link: http://lomex.hu/hu/webshop/#/page,0/search,82-07-86/stype,1/sidx,1; Price (HUF): 2.00; Package: 0603; NI Part Number: -; NI PEN/DEB: -
F4 = 1206SFS100F/63-2: NI part number: 766260-01; ID: Oth_1206SFS100F/63-2_FUSE_1206; Order number: 1843826; Rating: 63VDC; Type: Slow Blow; Value: 1A; NI PEN/DEB: DEB; Distributor: Farnell; Link: http://hu.farnell.com/te-connectivity-raychem/1206sfs100f-63-2/fuse-smd-1206-1a/dp/1843826; Package: FUSE_1206; Part Number: 1206SFS100F/63-2; Price (HUF): 239
IC1 = TLV1117LV33DCYR: Single Output LDO; ID: IC_TLV1117LV33DCYR_SOT-223; Distributor: TI; Link: http://www.ti.com/product/TLV1117LV?keyMatch=TLV1117LV33DCYR&tisearch=Search-EN-Everything; Note: TLV1117; Order number: TLV1117LV33DCYR; Package: SOT-223; Part Number: TLV1117LV33DCYR; Price (HUF): 64; Type: Single Output LDO; NI part number: -; NI PEN/DEB: -
R7 = CR-03JL7--240R: NI part number: 612640-01; Tolerance: 5%; Note: NI: not in stock; ID: Res_0603_240R_0.1W_Chip; NI PEN/DEB: DEB; Type: Chip Resistor; Part Number: CR-03JL7--240R; Order Number: 81-12-26; Distributor: Lomex; Link: http://lomex.hu/hu/webshop/#/page,0/search,81-12-26/stype,1/sidx,1; Price (HUF): 0.80; Package: 0603

## Sheet Servo_Power_Supply.SchDoc
size A4; SheetNumber: 7; SheetTotal: 18
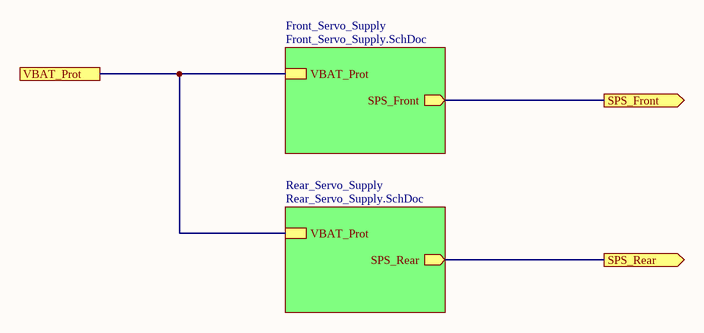
[diagram p6: Servo_Power_Supply.SchDoc]

### Sub-sheets
Front_Servo_Supply = Front_Servo_Supply.SchDoc: VBAT_Prot, SPS_Front (out)
Rear_Servo_Supply = Rear_Servo_Supply.SchDoc: VBAT_Prot, SPS_Rear (out)

### Ports
SPS_Front (out), SPS_Rear (out), VBAT_Prot

### Nets
8V4_F: port SPS_Front, sheet Front_Servo_Supply/SPS_Front
8V4_R: port SPS_Rear, sheet Rear_Servo_Supply/SPS_Rear
VBAT_Prot: port VBAT_Prot, sheet Front_Servo_Supply/VBAT_Prot, sheet Rear_Servo_Supply/VBAT_Prot

## Sheet Front_Servo_Supply.SchDoc
size A4; SheetNumber: 8; SheetTotal: 18
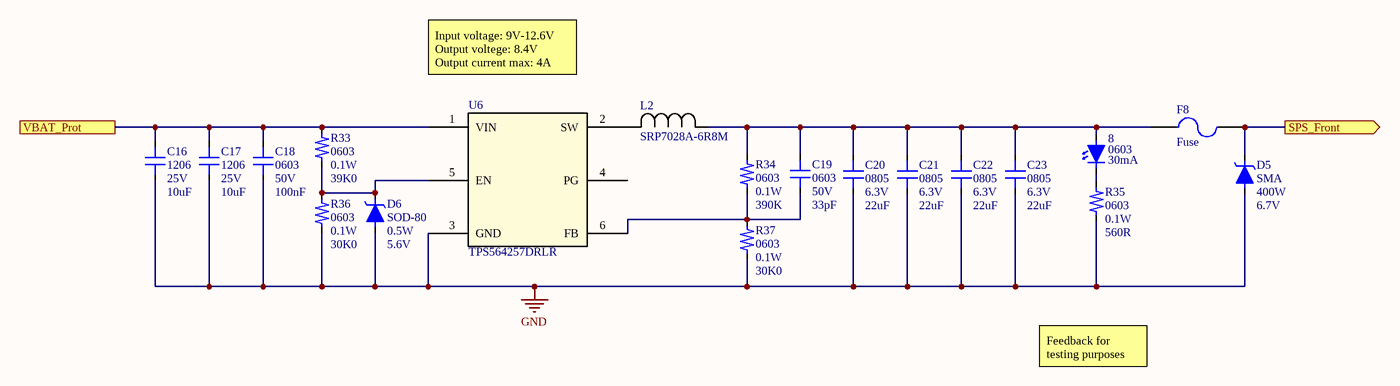
[diagram p7: Front_Servo_Supply.SchDoc]

### Parts
8  0603  Rating: 30mA  [LED_0603]
C16  1206  value 10uF  Rating: 25V  [C_1206]
C17  1206  value 10uF  Rating: 25V  [C_1206]
C18  0603  value 100nF  Rating: 50V  [C_0603]
C19  0603  value 33pF  Rating: 50V  [C_0603]
C20  0805  value 22uF  Rating: 6.3V  [C_0805]
C21  0805  value 22uF  Rating: 6.3V  [C_0805]
C22  0805  value 22uF  Rating: 6.3V  [C_0805]
C23  0805  value 22uF  Rating: 6.3V  [C_0805]
D5  SMA  value 6.7V  Rating: 400W  [SMA]
D6  SOD-80  value 5.6V  Rating: 0.5W  [SOD-80]
F8  Fuse  [F_2410]
L2  SRP7028A-6R8M  [IND_SRP7028A-6R8M_BRN]
R33  0603  value 39K0  Rating: 0.1W  [R_0603]
R34  0603  value 390K  Rating: 0.1W  [R_0603]
R35  0603  value 560R  Rating: 0.1W  [R_0603]
R36  0603  value 30K0  Rating: 0.1W  [R_0603]
R37  0603  value 30K0  Rating: 0.1W  [R_0603]
U6  TPS564257DRLR  [TPS564242DRLR_TEX]

### Ports
SPS_Front (out), VBAT_Prot

### Nets
8V4_F: D5.1(DC) F8.2 ; port SPS_Front
GND: C16.1(C1) C17.1(C1) C18.1(C1) C20.1(C1) C21.1(C1) C22.1(C1) C23.1(C1) D5.2(DA) D6.2(DA) R35.1(R1) R36.1(R1) R37.1(R1) U6.3(GND)
VBAT_Prot: C16.2(C2) C17.2(C2) C18.2(C2) R33.2(R2) U6.1(VIN) ; port VBAT_Prot
Net8_1: 8.1(DC) R35.2(R2)
Net8_2: 8.2(DA) C19.2(C2) C20.2(C2) C21.2(C2) C22.2(C2) C23.2(C2) F8.1 L2.1 R34.2(R2)
NetC19_1: C19.1(C1) R34.1(R1) R37.2(R2) U6.6(FB)
NetD6_1: D6.1(DC) R33.1(R1) R36.2(R2) U6.5(EN)
NetL2_2: L2.2 U6.2(SW)

Not connected (* = marked no-connect by the designer): U6 4(PG)

### Notes on the sheet
- Input voltage: 9V-12.6V
  Output voltege: 8.4V
  Output current max: 4A
- Feedback for testing purposes

### Library data of the parts
8 = Opt_FYLS-0603UGC_LED_0603_Green_30mA_Diode_LED: Note: 40mcd; Tolerance: 5%; Distributor: Lomex; Link: http://lomex.hu/hu/webshop/#/page,0/stype,1/sidx,10/instock,0/search,95-03-08; Order Number: 95-03-08; Package: 0603; Part Number: FYLS-0603UGC; Price (HUF): 10; Type: LED; ID: Opt_FYLS-0603UGC_LED_0603_Green_30mA_Diode_LED
C16 C17 = C3216X7R1E106K160AB: as C1 on sheet 5V_Supply; Part Number: C3216X7R1E106K160AB; Distributor: Farnell; Link: http://hu.farnell.com/tdk/c3216x7r1e106k160ab/capacitor-mlcc-x7r-10uf-25v-1206/dp/2522133; Price (HUF): 109; Package: 1206; NI Part Number: -; NI PEN/DEB: -
C18 = CC0603KRX7R9BB104: as C3 on sheet 5V_Supply; Part Number: CC0603KRX7R9BB104; Order Number: 82-06-23; Distributor: Lomex; Link: http://lomex.hu/hu/webshop/#/page,0/search,82-06-23/stype,1/sidx,1; Price (HUF): 2.00; Package: 0603
C19 = CL10C330JB8NNNC: as C4 on sheet 5V_Supply; Part Number: CL10C330JB8NNNC; Order Number: 82-09-74; Distributor: Lomex; Link: http://lomex.hu/hu/webshop/#/page,0/search,82-09-74/stype,1/sidx,1; Price (HUF): 2.00; Package: 0603
C20-C23 = CL21A226MQQNNNG: as C5 on sheet 5V_Supply; Part Number: CL21A226MQQNNNG; Order Number: 82-08-19; Distributor: Lomex; Link: http://lomex.hu/hu/webshop/#/page,0/search,82-08-19/stype,1/sidx,1; Price (HUF): 2.00; Package: 0805; NI Part Number: -; NI PEN/DEB: -
D5 = SMAJ5.0A: as D3 on sheet 5V_Supply; Distributor: Lomex; Link: http://lomex.hu/hu/webshop/#/search,96-00-75/stype,1; Order Number: 96-00-75; Package: SMA; Part Number: SMAJ5.0A; Price (HUF): 20; NI part number: -; NI PEN/DEB: -
D6 = BZV55C5V6: as D4 on sheet 5V_Supply; Distributor: Lomex; Link: http://lomex.hu/hu/webshop/#/page,0/search,85-01-72/stype,1/sidx,1; Order Number: 85-01-72; Package: SOD-80; Part Number: BZV55C5V6; Price (HUF): 5; NI part number: -; NI PEN/DEB: -
F8 = 0451003.MRL: as F2 on sheet Supply_Protection; Distributor: Lomex; Link: http://lomex.hu/hu/webshop/#page,0/search,44-02-68/stype,1; Order number: 44-02-68; Package: F_2410; Part Number: 0451003.MRL; Price (HUF): 33; NI part number: -; NI PEN/DEB: -
L2 = SRP7028A-6R8M: as L1 on sheet 5V_Supply; Copyright: Copyright (C) 2023 Ultra Librarian. All rights reserved.; Manufacturer_Part_Number: SRP7028A-6R8M; RefDes: RefDes
R33 = CR-03JL7---39K: as R2 on sheet 5V_Supply; Type: Chip Resistor; Part Number: CR-03JL7---39K; Order Number: 81-10-45; Distributor: Lomex; Link: http://lomex.hu/hu/webshop/#/page,0/search,81-10-45/stype,1/sidx,1; Price (HUF): 0.80; Package: 0603
R34 = CR-03FL7--390K: Tolerance: 1%; ID: Res_0603_390K_0.1W_Chip; Type: Chip Resistor; Part Number: CR-03FL7--390K; Order Number: 80-13-26; Distributor: Lomex; Link: http://lomex.hu/hu/webshop/#/page,0/search,80-13-26/stype,1/sidx,1; Price (HUF): 0.80; Package: 0603; NI part number: -; NI PEN/DEB: -
R35 = CR-03FL7--560R: NI part number: 612556-01; Tolerance: 1%; Note: NI: not in stock; ID: Res_0603_560R_0.1W_Chip; NI PEN/DEB: DEB; Type: Chip Resistor; Part Number: CR-03FL7--560R; Order Number: 80-14-41; Distributor: Lomex; Link: http://lomex.hu/hu/webshop/#/page,0/search,80-14-41/stype,1/sidx,1; Price (HUF): 0.80; Package: 0603
R36 R37 = CR-03FL7---30K: as R5 on sheet 5V_Supply; Type: Chip Resistor; Part Number: CR-03FL7---30K; Order Number: 80-14-53; Distributor: Lomex; Link: http://lomex.hu/hu/webshop/#/page,0/search,80-14-53/stype,1/sidx,1; Price (HUF): 0.80; Package: 0603
U6 = TPS564257DRLR: as U2 on sheet 5V_Supply; Type: DEV; Copyright: Copyright (C) 2023 Ultra Librarian. All rights reserved.; Manufacturer_Part_Number: TPS564257DRLR; RefDes: RefDes

## Sheet Rear_Servo_Supply.SchDoc
size A4; SheetNumber: 9; SheetTotal: 18
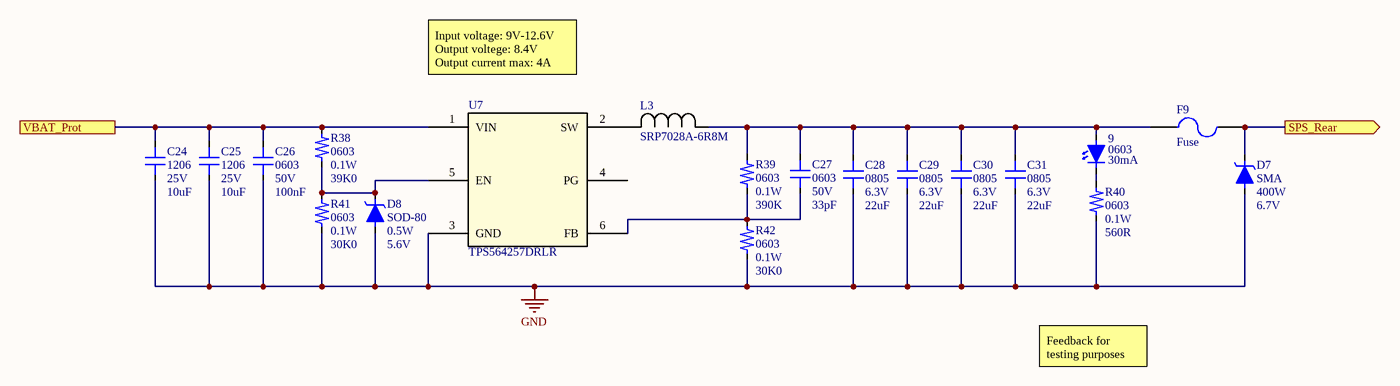
[diagram p8: Rear_Servo_Supply.SchDoc]

### Parts
9  0603  Rating: 30mA  [LED_0603]
C24  1206  value 10uF  Rating: 25V  [C_1206]
C25  1206  value 10uF  Rating: 25V  [C_1206]
C26  0603  value 100nF  Rating: 50V  [C_0603]
C27  0603  value 33pF  Rating: 50V  [C_0603]
C28  0805  value 22uF  Rating: 6.3V  [C_0805]
C29  0805  value 22uF  Rating: 6.3V  [C_0805]
C30  0805  value 22uF  Rating: 6.3V  [C_0805]
C31  0805  value 22uF  Rating: 6.3V  [C_0805]
D7  SMA  value 6.7V  Rating: 400W  [SMA]
D8  SOD-80  value 5.6V  Rating: 0.5W  [SOD-80]
F9  Fuse  [F_2410]
L3  SRP7028A-6R8M  [IND_SRP7028A-6R8M_BRN]
R38  0603  value 39K0  Rating: 0.1W  [R_0603]
R39  0603  value 390K  Rating: 0.1W  [R_0603]
R40  0603  value 560R  Rating: 0.1W  [R_0603]
R41  0603  value 30K0  Rating: 0.1W  [R_0603]
R42  0603  value 30K0  Rating: 0.1W  [R_0603]
U7  TPS564257DRLR  [TPS564242DRLR_TEX]

### Ports
SPS_Rear (out), VBAT_Prot

### Nets
8V4_R: D7.1(DC) F9.2 ; port SPS_Rear
GND: C24.1(C1) C25.1(C1) C26.1(C1) C28.1(C1) C29.1(C1) C30.1(C1) C31.1(C1) D7.2(DA) D8.2(DA) R40.1(R1) R41.1(R1) R42.1(R1) U7.3(GND)
VBAT_Prot: C24.2(C2) C25.2(C2) C26.2(C2) R38.2(R2) U7.1(VIN) ; port VBAT_Prot
Net9_1: 9.1(DC) R40.2(R2)
Net9_2: 9.2(DA) C27.2(C2) C28.2(C2) C29.2(C2) C30.2(C2) C31.2(C2) F9.1 L3.1 R39.2(R2)
NetC27_1: C27.1(C1) R39.1(R1) R42.2(R2) U7.6(FB)
NetD8_1: D8.1(DC) R38.1(R1) R41.2(R2) U7.5(EN)
NetL3_2: L3.2 U7.2(SW)

Not connected (* = marked no-connect by the designer): U7 4(PG)

### Notes on the sheet
- Input voltage: 9V-12.6V
  Output voltege: 8.4V
  Output current max: 4A
- Feedback for testing purposes

### Library data of the parts
9 = Opt_FYLS-0603UGC_LED_0603_Green_30mA_Diode_LED: Note: 40mcd; Tolerance: 5%; Distributor: Lomex; Link: http://lomex.hu/hu/webshop/#/page,0/stype,1/sidx,10/instock,0/search,95-03-08; Order Number: 95-03-08; Package: 0603; Part Number: FYLS-0603UGC; Price (HUF): 10; Type: LED; ID: Opt_FYLS-0603UGC_LED_0603_Green_30mA_Diode_LED
C24 C25 = C3216X7R1E106K160AB: as C1 on sheet 5V_Supply; Part Number: C3216X7R1E106K160AB; Distributor: Farnell; Link: http://hu.farnell.com/tdk/c3216x7r1e106k160ab/capacitor-mlcc-x7r-10uf-25v-1206/dp/2522133; Price (HUF): 109; Package: 1206; NI Part Number: -; NI PEN/DEB: -
C26 = CC0603KRX7R9BB104: as C3 on sheet 5V_Supply; Part Number: CC0603KRX7R9BB104; Order Number: 82-06-23; Distributor: Lomex; Link: http://lomex.hu/hu/webshop/#/page,0/search,82-06-23/stype,1/sidx,1; Price (HUF): 2.00; Package: 0603
C27 = CL10C330JB8NNNC: as C4 on sheet 5V_Supply; Part Number: CL10C330JB8NNNC; Order Number: 82-09-74; Distributor: Lomex; Link: http://lomex.hu/hu/webshop/#/page,0/search,82-09-74/stype,1/sidx,1; Price (HUF): 2.00; Package: 0603
C28-C31 = CL21A226MQQNNNG: as C5 on sheet 5V_Supply; Part Number: CL21A226MQQNNNG; Order Number: 82-08-19; Distributor: Lomex; Link: http://lomex.hu/hu/webshop/#/page,0/search,82-08-19/stype,1/sidx,1; Price (HUF): 2.00; Package: 0805; NI Part Number: -; NI PEN/DEB: -
D7 = SMAJ5.0A: as D3 on sheet 5V_Supply; Distributor: Lomex; Link: http://lomex.hu/hu/webshop/#/search,96-00-75/stype,1; Order Number: 96-00-75; Package: SMA; Part Number: SMAJ5.0A; Price (HUF): 20; NI part number: -; NI PEN/DEB: -
D8 = BZV55C5V6: as D4 on sheet 5V_Supply; Distributor: Lomex; Link: http://lomex.hu/hu/webshop/#/page,0/search,85-01-72/stype,1/sidx,1; Order Number: 85-01-72; Package: SOD-80; Part Number: BZV55C5V6; Price (HUF): 5; NI part number: -; NI PEN/DEB: -
F9 = 0451003.MRL: as F2 on sheet Supply_Protection; Distributor: Lomex; Link: http://lomex.hu/hu/webshop/#page,0/search,44-02-68/stype,1; Order number: 44-02-68; Package: F_2410; Part Number: 0451003.MRL; Price (HUF): 33; NI part number: -; NI PEN/DEB: -
L3 = SRP7028A-6R8M: as L1 on sheet 5V_Supply; Copyright: Copyright (C) 2023 Ultra Librarian. All rights reserved.; Manufacturer_Part_Number: SRP7028A-6R8M; RefDes: RefDes
R38 = CR-03JL7---39K: as R2 on sheet 5V_Supply; Type: Chip Resistor; Part Number: CR-03JL7---39K; Order Number: 81-10-45; Distributor: Lomex; Link: http://lomex.hu/hu/webshop/#/page,0/search,81-10-45/stype,1/sidx,1; Price (HUF): 0.80; Package: 0603
R39 = CR-03FL7--390K: as R34 on sheet Front_Servo_Supply; Type: Chip Resistor; Part Number: CR-03FL7--390K; Order Number: 80-13-26; Distributor: Lomex; Link: http://lomex.hu/hu/webshop/#/page,0/search,80-13-26/stype,1/sidx,1; Price (HUF): 0.80; Package: 0603; NI part number: -; NI PEN/DEB: -
R40 = CR-03FL7--560R: as R35 on sheet Front_Servo_Supply; Type: Chip Resistor; Part Number: CR-03FL7--560R; Order Number: 80-14-41; Distributor: Lomex; Link: http://lomex.hu/hu/webshop/#/page,0/search,80-14-41/stype,1/sidx,1; Price (HUF): 0.80; Package: 0603
R41 R42 = CR-03FL7---30K: as R5 on sheet 5V_Supply; Type: Chip Resistor; Part Number: CR-03FL7---30K; Order Number: 80-14-53; Distributor: Lomex; Link: http://lomex.hu/hu/webshop/#/page,0/search,80-14-53/stype,1/sidx,1; Price (HUF): 0.80; Package: 0603
U7 = TPS564257DRLR: as U2 on sheet 5V_Supply; Type: DEV; Copyright: Copyright (C) 2023 Ultra Librarian. All rights reserved.; Manufacturer_Part_Number: TPS564257DRLR; RefDes: RefDes

## Sheet IMU.SchDoc
size A4; SheetNumber: 10; SheetTotal: 18
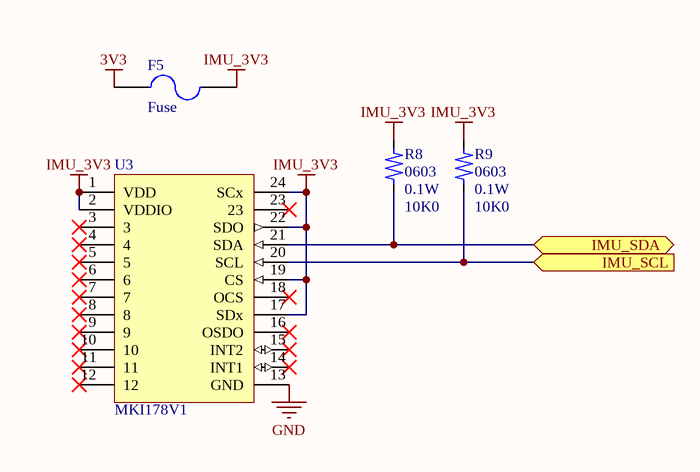
[diagram p9: IMU.SchDoc]

### Parts
F5  Fuse  [F_0603]
R8  0603  value 10K0  Rating: 0.1W  [R_0603]
R9  0603  value 10K0  Rating: 0.1W  [R_0603]
U3  MKI178V1  [FP_DIL24]

### Ports
IMU_SCL (in), IMU_SDA (bidir)

### Nets
3V3: F5.1
GND: U3.13(GND)
IMU_3V3: F5.2 R8.2(R2) R9.2(R2) U3.1(VDD) U3.2(VDDIO) U3.17(SDx) U3.19(CS) U3.22(SDO) U3.24(SCx)
SCL: R9.1(R1) U3.20(SCL) ; port IMU_SCL
SDA: R8.1(R1) U3.21(SDA) ; port IMU_SDA

Not connected (* = marked no-connect by the designer): U3 3* 4* 5* 6* 7* 8* 9* 10* 11* 12* 14(INT1)* 15(INT2)* 16(OSDO)* 18(OCS)* 23*

### Library data of the parts
F5 = Oth_MC06CF.500_F_0603: as F1 on sheet MCU; Distributor: Farnell; ID: Oth_MC06CF.500_F_0603; Link: http://hu.farnell.com/multicomp/mc06cf-500/fuse-smd-0603-0-5a/dp/1841006; Package: F_0603; Part Number: MC06CF.500; Price (HUF): 125
R8 R9 = CR-03FL7---10K: as R1 on sheet Supply_Protection; Type: Chip Resistor; Part Number: CR-03FL7---10K; Order Number: 80-11-68; Distributor: Lomex; Link: http://lomex.hu/hu/webshop/#/page,0/search,80-11-68/stype,1/sidx,1; Price (HUF): 0.80; Package: 0603
U3 = MKI178V1: LSM6DSL inertial module adapter; Name: MKI178V1 LSM6DSL inertial module adapter; Reference: 511-STEVAL-MKI178V1; Supplier: Mouser

## Sheet Telemetry_Modul.SchDoc
size Letter; SheetNumber: 11; SheetTotal: 18
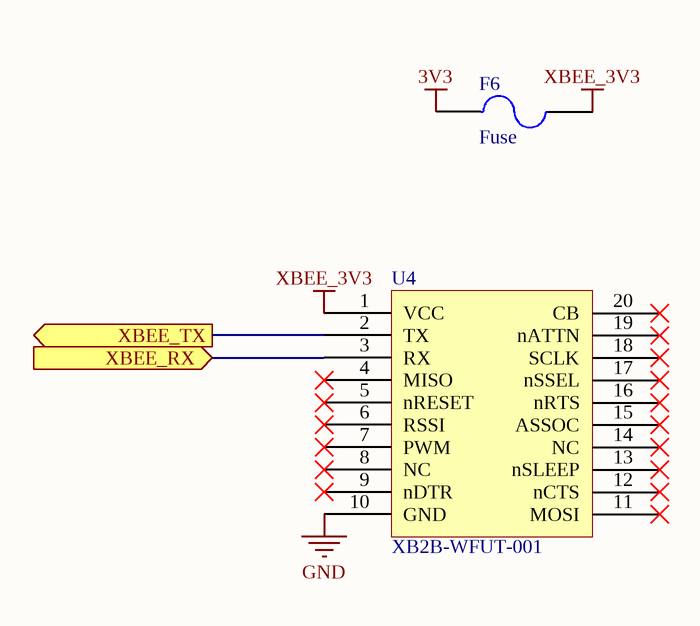
[diagram p10: Telemetry_Modul.SchDoc]

### Parts
F6  Fuse  [F_0603]
U4  XB2B-WFUT-001  [XBee (WiFi)]

### Ports
XBEE_RX (in), XBEE_TX (out)

### Nets
3V3: F6.1
GND: U4.10(GND)
XBEE_3V3: F6.2 U4.1(VCC)
XBEE_RX: U4.3(RX) ; port XBEE_RX
XBEE_TX: U4.2(TX) ; port XBEE_TX

Not connected (* = marked no-connect by the designer): U4 4(MISO)* 5(nRESET)* 6(RSSI)* 7(PWM)* 8(NC)* 9(nDTR)* 11(MOSI)* 12(nCTS)* 13(nSLEEP)* 14(NC)* 15(ASSOC)* 16(nRTS)* 17(nSSEL)* 18(SCLK)* 19(nATTN)* 20(CB)*

### Library data of the parts
F6 = Oth_MC06CF.500_F_0603: as F1 on sheet MCU; Distributor: Farnell; ID: Oth_MC06CF.500_F_0603; Link: http://hu.farnell.com/multicomp/mc06cf-500/fuse-smd-0603-0-5a/dp/1841006; Package: F_0603; Part Number: MC06CF.500; Price (HUF): 125
U4 = XBee: Order number: 2343884; Distributor: Farnell; Link: http://hu.farnell.com/digi-international/xb2b-wfut-001/mod-xbee-2-4ghz-wifi-u-fl-conn/dp/2343884?ost=2343884; Part Number: XB2B-WFUT-001; Price (HUF): 12000

## Sheet Radio_module.SchDoc
size A4; SheetNumber: 12; SheetTotal: 18
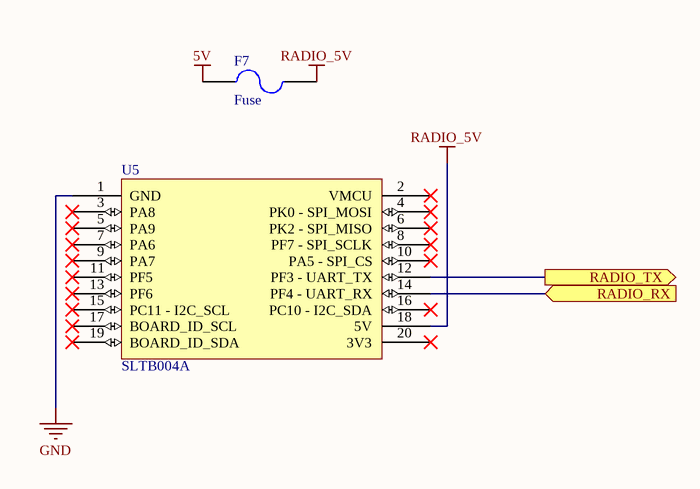
[diagram p11: Radio_module.SchDoc]

### Parts
F7  Fuse  [F_0603]
U5  SLTB004A  [SLTB004A]

### Ports
RADIO_RX (in), RADIO_TX (out)

### Nets
5V: F7.1
GND: U5.1(GND)
RADIO_5V: F7.2 U5.18(5V)
RADIO_RX: U5.14(PF4_-_UART_RX) ; port RADIO_RX
RADIO_TX: U5.12(PF3_-_UART_TX) ; port RADIO_TX

Not connected (* = marked no-connect by the designer): U5 2(VMCU)* 3(PA8)* 4(PK0_-_SPI_MOSI)* 5(PA9)* 6(PK2_-_SPI_MISO)* 7(PA6)* 8(PF7_-_SPI_SCLK)* 9(PA7)* 10(PA5_-_SPI_CS)* 11(PF5)* 13(PF6)* 15(PC11_-_I2C_SCL)* 16(PC10_-_I2C_SDA)* 17(BOARD_ID_SCL)* 19(BOARD_ID_SDA)* 20(3V3)*

### Library data of the parts
F7 = Oth_MC06CF.500_F_0603: as F1 on sheet MCU; Distributor: Farnell; ID: Oth_MC06CF.500_F_0603; Link: http://hu.farnell.com/multicomp/mc06cf-500/fuse-smd-0603-0-5a/dp/1841006; Package: F_0603; Part Number: MC06CF.500; Price (HUF): 125
U5 = SLTB004A: SiLabs Thunderboard Sense 2 module

## Sheet HMI.SchDoc
size A4; SheetNumber: 13; SheetTotal: 18
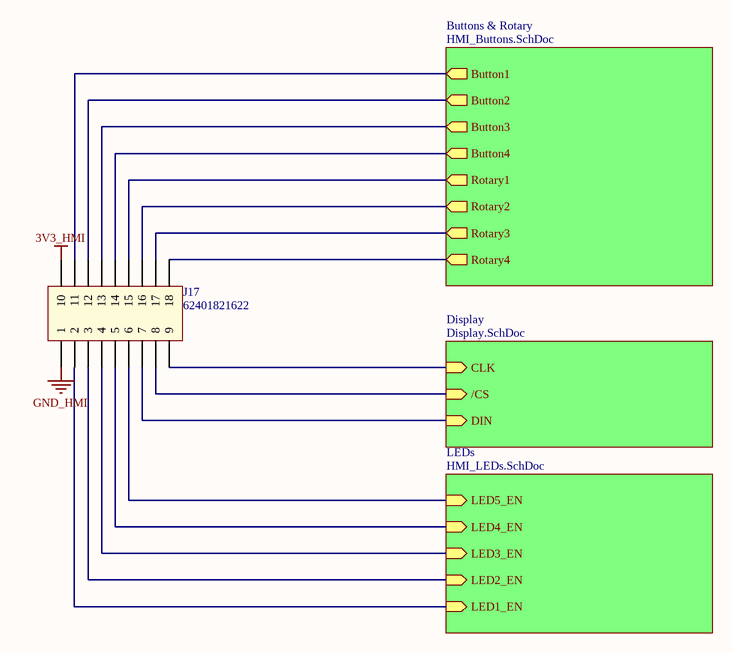
[diagram p12: HMI.SchDoc]

### Parts
J17  62401821622  [62401821622]

### Sub-sheets
Buttons & Rotary = HMI_Buttons.SchDoc: Button1 (out), Button2 (out), Button3 (out), Button4 (out), Rotary1 (out), Rotary2 (out), Rotary3 (out), Rotary4 (out)
Display = Display.SchDoc: DIN (in), /CS (in), CLK (in)
LEDs = HMI_LEDs.SchDoc: LED1_EN (in), LED2_EN (in), LED3_EN (in), LED4_EN (in), LED5_EN (in)

### Nets
3V3_HMI: J17.10
GND_HMI: J17.1
/CS: J17.8 ; sheet Display//CS
CLK: J17.9 ; sheet Display/CLK
DIN: J17.7 ; sheet Display/DIN
NetC12_2: J17.11 ; sheet Buttons & Rotary/Button1
NetC13_2: J17.12 ; sheet Buttons & Rotary/Button2
NetC14_2: J17.13 ; sheet Buttons & Rotary/Button3
NetC15_2: J17.14 ; sheet Buttons & Rotary/Button4
NetJ17_2: J17.2 ; sheet LEDs/LED1_EN
NetJ17_3: J17.3 ; sheet LEDs/LED2_EN
NetJ17_4: J17.4 ; sheet LEDs/LED3_EN
NetJ17_5: J17.5 ; sheet LEDs/LED4_EN
NetJ17_6: J17.6 ; sheet LEDs/LED5_EN
NetJ17_15: J17.15 ; sheet Buttons & Rotary/Rotary1
NetJ17_16: J17.16 ; sheet Buttons & Rotary/Rotary2
NetJ17_17: J17.17 ; sheet Buttons & Rotary/Rotary3
NetJ17_18: J17.18 ; sheet Buttons & Rotary/Rotary4

### Library data of the parts
J17 = 62401821622: as J16 on sheet MainSheet; ComponentLink1Description: Manufacturer; ComponentLink1URL: http://www.we-online.de; ComponentLink2Description: Datasheet; ComponentLink2URL: http://katalog.we-online.de/em/datasheet/6240xx21622.pdf; Part Number: 62401821622; Published Date: June 2017; Publisher: Wurth Elektronik; Pitch: 2.00 mm; Order Number: 62401821622; Package: 62401821622; NI part number: -; NI PEN/DEB: -; Type: Header WE 18-way; Distributor: Würth; Link: http://katalog.we-online.de/em/datasheet/6240xx21622.pdf; Price (HUF): 0; Note: Positive Lock

## Sheet HMI_LEDs.SchDoc
size A4; SheetNumber: 14; SheetTotal: 18
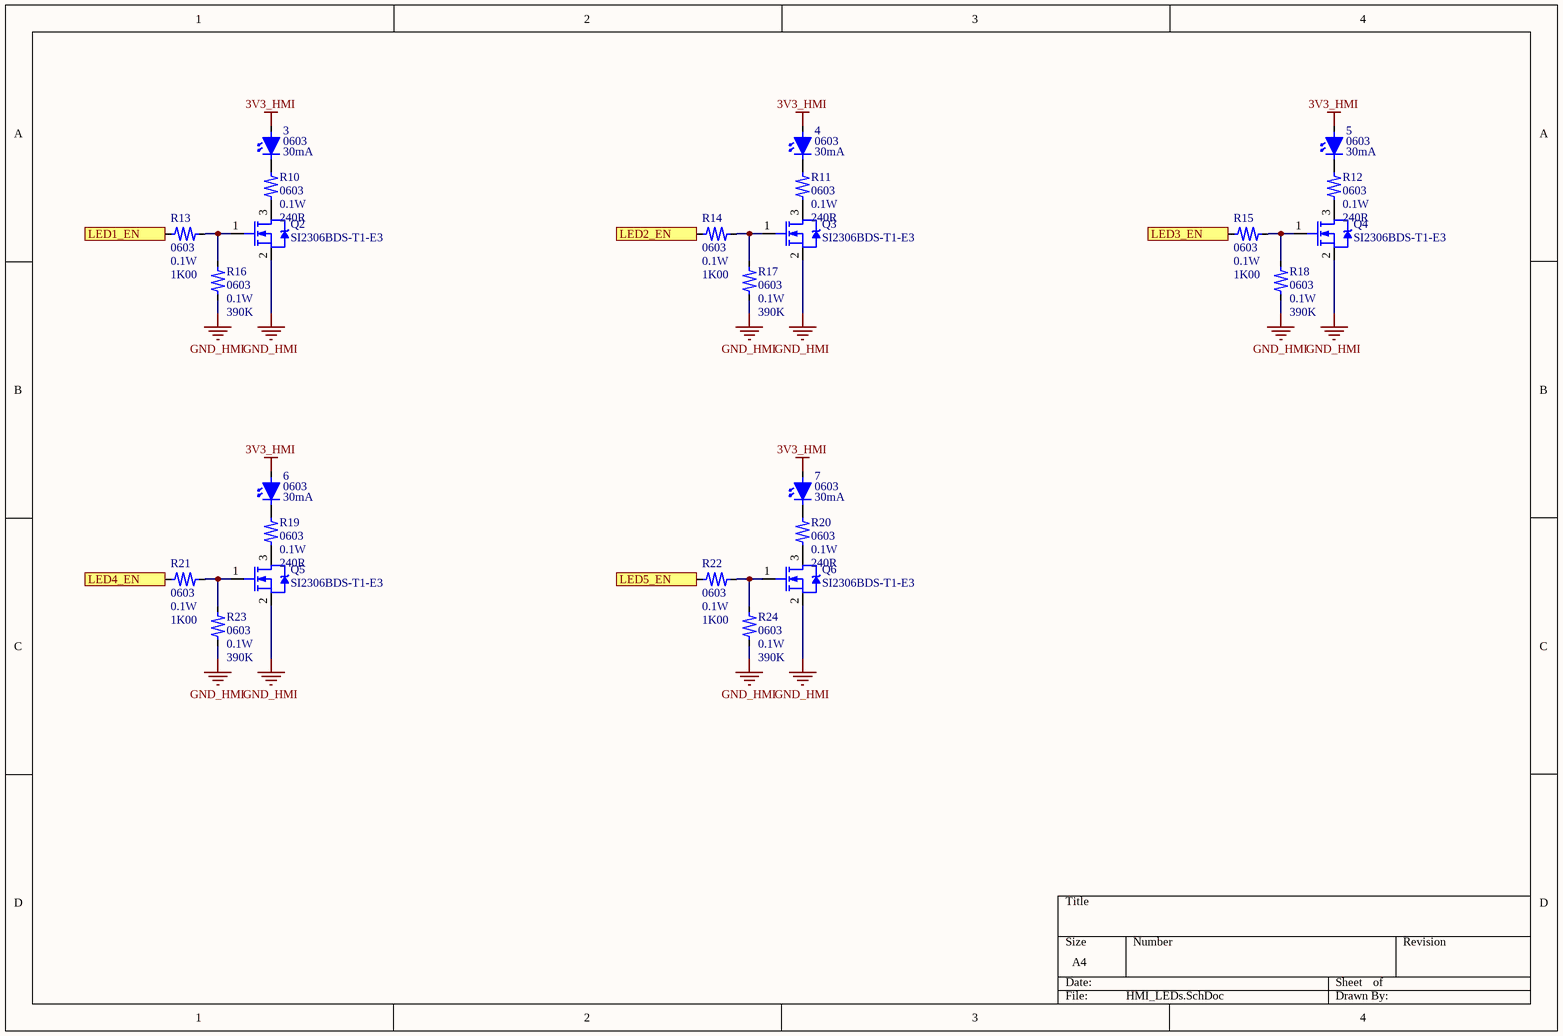
[diagram p13: HMI_LEDs.SchDoc]

### Parts
3  0603  Rating: 30mA  [LED_0603]
4  0603  Rating: 30mA  [LED_0603]
5  0603  Rating: 30mA  [LED_0603]
6  0603  Rating: 30mA  [LED_0603]
7  0603  Rating: 30mA  [LED_0603]
Q2  SI2306BDS-T1-E3  [SOT-23-3]
Q3  SI2306BDS-T1-E3  [SOT-23-3]
Q4  SI2306BDS-T1-E3  [SOT-23-3]
Q5  SI2306BDS-T1-E3  [SOT-23-3]
Q6  SI2306BDS-T1-E3  [SOT-23-3]
R10  0603  value 240R  Rating: 0.1W  [R_0603]
R11  0603  value 240R  Rating: 0.1W  [R_0603]
R12  0603  value 240R  Rating: 0.1W  [R_0603]
R13  0603  value 1K00  Rating: 0.1W  [R_0603]
R14  0603  value 1K00  Rating: 0.1W  [R_0603]
R15  0603  value 1K00  Rating: 0.1W  [R_0603]
R16  0603  value 390K  Rating: 0.1W  [R_0603]
R17  0603  value 390K  Rating: 0.1W  [R_0603]
R18  0603  value 390K  Rating: 0.1W  [R_0603]
R19  0603  value 240R  Rating: 0.1W  [R_0603]
R20  0603  value 240R  Rating: 0.1W  [R_0603]
R21  0603  value 1K00  Rating: 0.1W  [R_0603]
R22  0603  value 1K00  Rating: 0.1W  [R_0603]
R23  0603  value 390K  Rating: 0.1W  [R_0603]
R24  0603  value 390K  Rating: 0.1W  [R_0603]

### Ports
LED1_EN (in), LED2_EN (in), LED3_EN (in), LED4_EN (in), LED5_EN (in)

### Nets
3V3_HMI: 3.2(DA) 4.2(DA) 5.2(DA) 6.2(DA) 7.2(DA)
GND_HMI: Q2.2(S) Q3.2(S) Q4.2(S) Q5.2(S) Q6.2(S) R16.1(R1) R17.1(R1) R18.1(R1) R23.1(R1) R24.1(R1)
Net3_1: 3.1(DC) R10.2(R2)
Net4_1: 4.1(DC) R11.2(R2)
Net5_1: 5.1(DC) R12.2(R2)
Net6_1: 6.1(DC) R19.2(R2)
Net7_1: 7.1(DC) R20.2(R2)
NetJ17_2: R13.1(R1) ; port LED1_EN
NetJ17_3: R14.1(R1) ; port LED2_EN
NetJ17_4: R15.1(R1) ; port LED3_EN
NetJ17_5: R21.1(R1) ; port LED4_EN
NetJ17_6: R22.1(R1) ; port LED5_EN
NetQ2_1: Q2.1(G) R13.2(R2) R16.2(R2)
NetQ2_3: Q2.3(D) R10.1(R1)
NetQ3_1: Q3.1(G) R14.2(R2) R17.2(R2)
NetQ3_3: Q3.3(D) R11.1(R1)
NetQ4_1: Q4.1(G) R15.2(R2) R18.2(R2)
NetQ4_3: Q4.3(D) R12.1(R1)
NetQ5_1: Q5.1(G) R21.2(R2) R23.2(R2)
NetQ5_3: Q5.3(D) R19.1(R1)
NetQ6_1: Q6.1(G) R22.2(R2) R24.2(R2)
NetQ6_3: Q6.3(D) R20.1(R1)

### Library data of the parts
3-7 = Opt_FYLS-0603UGC_LED_0603_Green_30mA_Diode_LED: Note: 40mcd; Tolerance: 5%; Distributor: Lomex; Link: http://lomex.hu/hu/webshop/#/page,0/stype,1/sidx,10/instock,0/search,95-03-08; Order Number: 95-03-08; Package: 0603; Part Number: FYLS-0603UGC; Price (HUF): 10; Type: LED; ID: Opt_FYLS-0603UGC_LED_0603_Green_30mA_Diode_LED
Q2-Q6 = SI2306BDS-T1-E3: N-Channel Power MOSFET; ID: Tra_SOT-23-3_30V_4A_N-FET; Rating: 4A; Type: N-FET; Value: 30V; Distributor: Lomex; Link: http://lomex.hu/hu/webshop/#/page,0/stype,1/sidx,10/instock,0/search,86-01-57; Order number: 86-01-57; Package: SOT-23-3; Part Number: SI2306BDS-T1-E3; Price (HUF): 83; NI part number: -; NI PEN/DEB: -
R10-R12 R19 R20 = CR-03JL7--240R: as R7 on sheet 3V3_Supply; Type: Chip Resistor; Part Number: CR-03JL7--240R; Order Number: 81-12-26; Distributor: Lomex; Link: http://lomex.hu/hu/webshop/#/page,0/search,81-12-26/stype,1/sidx,1; Price (HUF): 0.80; Package: 0603
R13-R15 R21 R22 = CR-03FL7----1K: NI part number: 713776-01; Tolerance: 1%; ID: Res_0603_1K00_0.1W_Chip; NI PEN/DEB: DEB; Type: Chip Resistor; Part Number: CR-03FL7----1K; Order Number: 80-11-59; Distributor: Lomex; Link: http://lomex.hu/hu/webshop/#/page,0/search,80-11-59/stype,1/sidx,1; Price (HUF): 0.80; Package: 0603
R16-R18 R23 R24 = CR-03FL7--390K: as R34 on sheet Front_Servo_Supply; Type: Chip Resistor; Part Number: CR-03FL7--390K; Order Number: 80-13-26; Distributor: Lomex; Link: http://lomex.hu/hu/webshop/#/page,0/search,80-13-26/stype,1/sidx,1; Price (HUF): 0.80; Package: 0603; NI part number: -; NI PEN/DEB: -

## Sheet HMI_Buttons.SchDoc
size A4; SheetNumber: 15; SheetTotal: 18
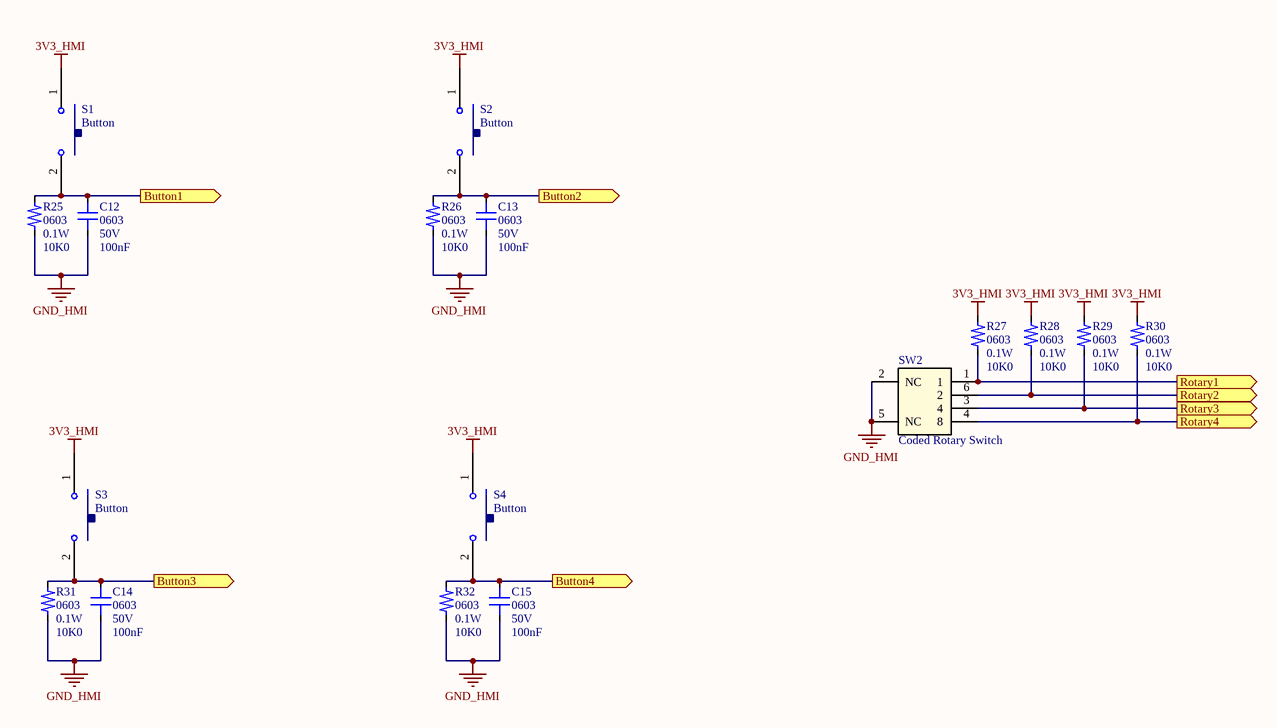
[diagram p14: HMI_Buttons.SchDoc]

### Parts
C12  0603  value 100nF  Rating: 50V  [C_0603]
C13  0603  value 100nF  Rating: 50V  [C_0603]
C14  0603  value 100nF  Rating: 50V  [C_0603]
C15  0603  value 100nF  Rating: 50V  [C_0603]
R25  0603  value 10K0  Rating: 0.1W  [R_0603]
R26  0603  value 10K0  Rating: 0.1W  [R_0603]
R27  0603  value 10K0  Rating: 0.1W  [R_0603]
R28  0603  value 10K0  Rating: 0.1W  [R_0603]
R29  0603  value 10K0  Rating: 0.1W  [R_0603]
R30  0603  value 10K0  Rating: 0.1W  [R_0603]
R31  0603  value 10K0  Rating: 0.1W  [R_0603]
R32  0603  value 10K0  Rating: 0.1W  [R_0603]
S1  Button  [Switch]
S2  Button  [Switch]
S3  Button  [Switch]
S4  Button  [Switch]
SW2  Coded Rotary Switch  [221AMC16R]

### Ports
Button1 (out), Button2 (out), Button3 (out), Button4 (out), Rotary1 (out), Rotary2 (out), Rotary3 (out), Rotary4 (out)

### Nets
3V3_HMI: R27.2(R2) R28.2(R2) R29.2(R2) R30.2(R2) S1.1 S2.1 S3.1 S4.1
GND_HMI: C12.1(C1) C13.1(C1) C14.1(C1) C15.1(C1) R25.1(R1) R26.1(R1) R31.1(R1) R32.1(R1) SW2.2(NC) SW2.5(NC)
NetC12_2: C12.2(C2) R25.2(R2) S1.2 ; port Button1
NetC13_2: C13.2(C2) R26.2(R2) S2.2 ; port Button2
NetC14_2: C14.2(C2) R31.2(R2) S3.2 ; port Button3
NetC15_2: C15.2(C2) R32.2(R2) S4.2 ; port Button4
NetJ17_15: R27.1(R1) SW2.1 ; port Rotary1
NetJ17_16: R28.1(R1) SW2.6(2) ; port Rotary2
NetJ17_17: R29.1(R1) SW2.3(4) ; port Rotary3
NetJ17_18: R30.1(R1) SW2.4(8) ; port Rotary4

### Library data of the parts
C12-C15 = CC0603KRX7R9BB104: as C3 on sheet 5V_Supply; Part Number: CC0603KRX7R9BB104; Order Number: 82-06-23; Distributor: Lomex; Link: http://lomex.hu/hu/webshop/#/page,0/search,82-06-23/stype,1/sidx,1; Price (HUF): 2.00; Package: 0603
R25-R32 = CR-03FL7---10K: as R1 on sheet Supply_Protection; Type: Chip Resistor; Part Number: CR-03FL7---10K; Order Number: 80-11-68; Distributor: Lomex; Link: http://lomex.hu/hu/webshop/#/page,0/search,80-11-68/stype,1/sidx,1; Price (HUF): 0.80; Package: 0603
S1-S4 = FSM2JSMA: ID: Oth_FSM2JSMA_SWITCH; Note: 4 Pin; Rating: 50mA; Distributor: Lomex; Link: http://lomex.hu/hu/webshop/#/page,0/stype,1/sidx,6/search,45-05-42; Order number: 45-05-42; Package: SWITCH; Part Number: FSM2JSMA; Price (HUF): 41; Type: Button; NI part number: -; NI PEN/DEB: -
SW2 = 221AMC16R: Number of positions: 16; Output code: Hexadecimal; Voltage rating: 50 V; Current rating: 100 mA; Link: https://hu.mouser.com/ProductDetail/CTS-Electronic-Components/221AMC16R?qs=%252BiOMRfgENTE0%252BGMxeYu5rQ%3D%3D